# EAGLE design BB-MIGRATED (EAGLE 5.11)
BOM: EXCLUDE; PARTNO: L3G4200DH

## Sheet 1 of 3
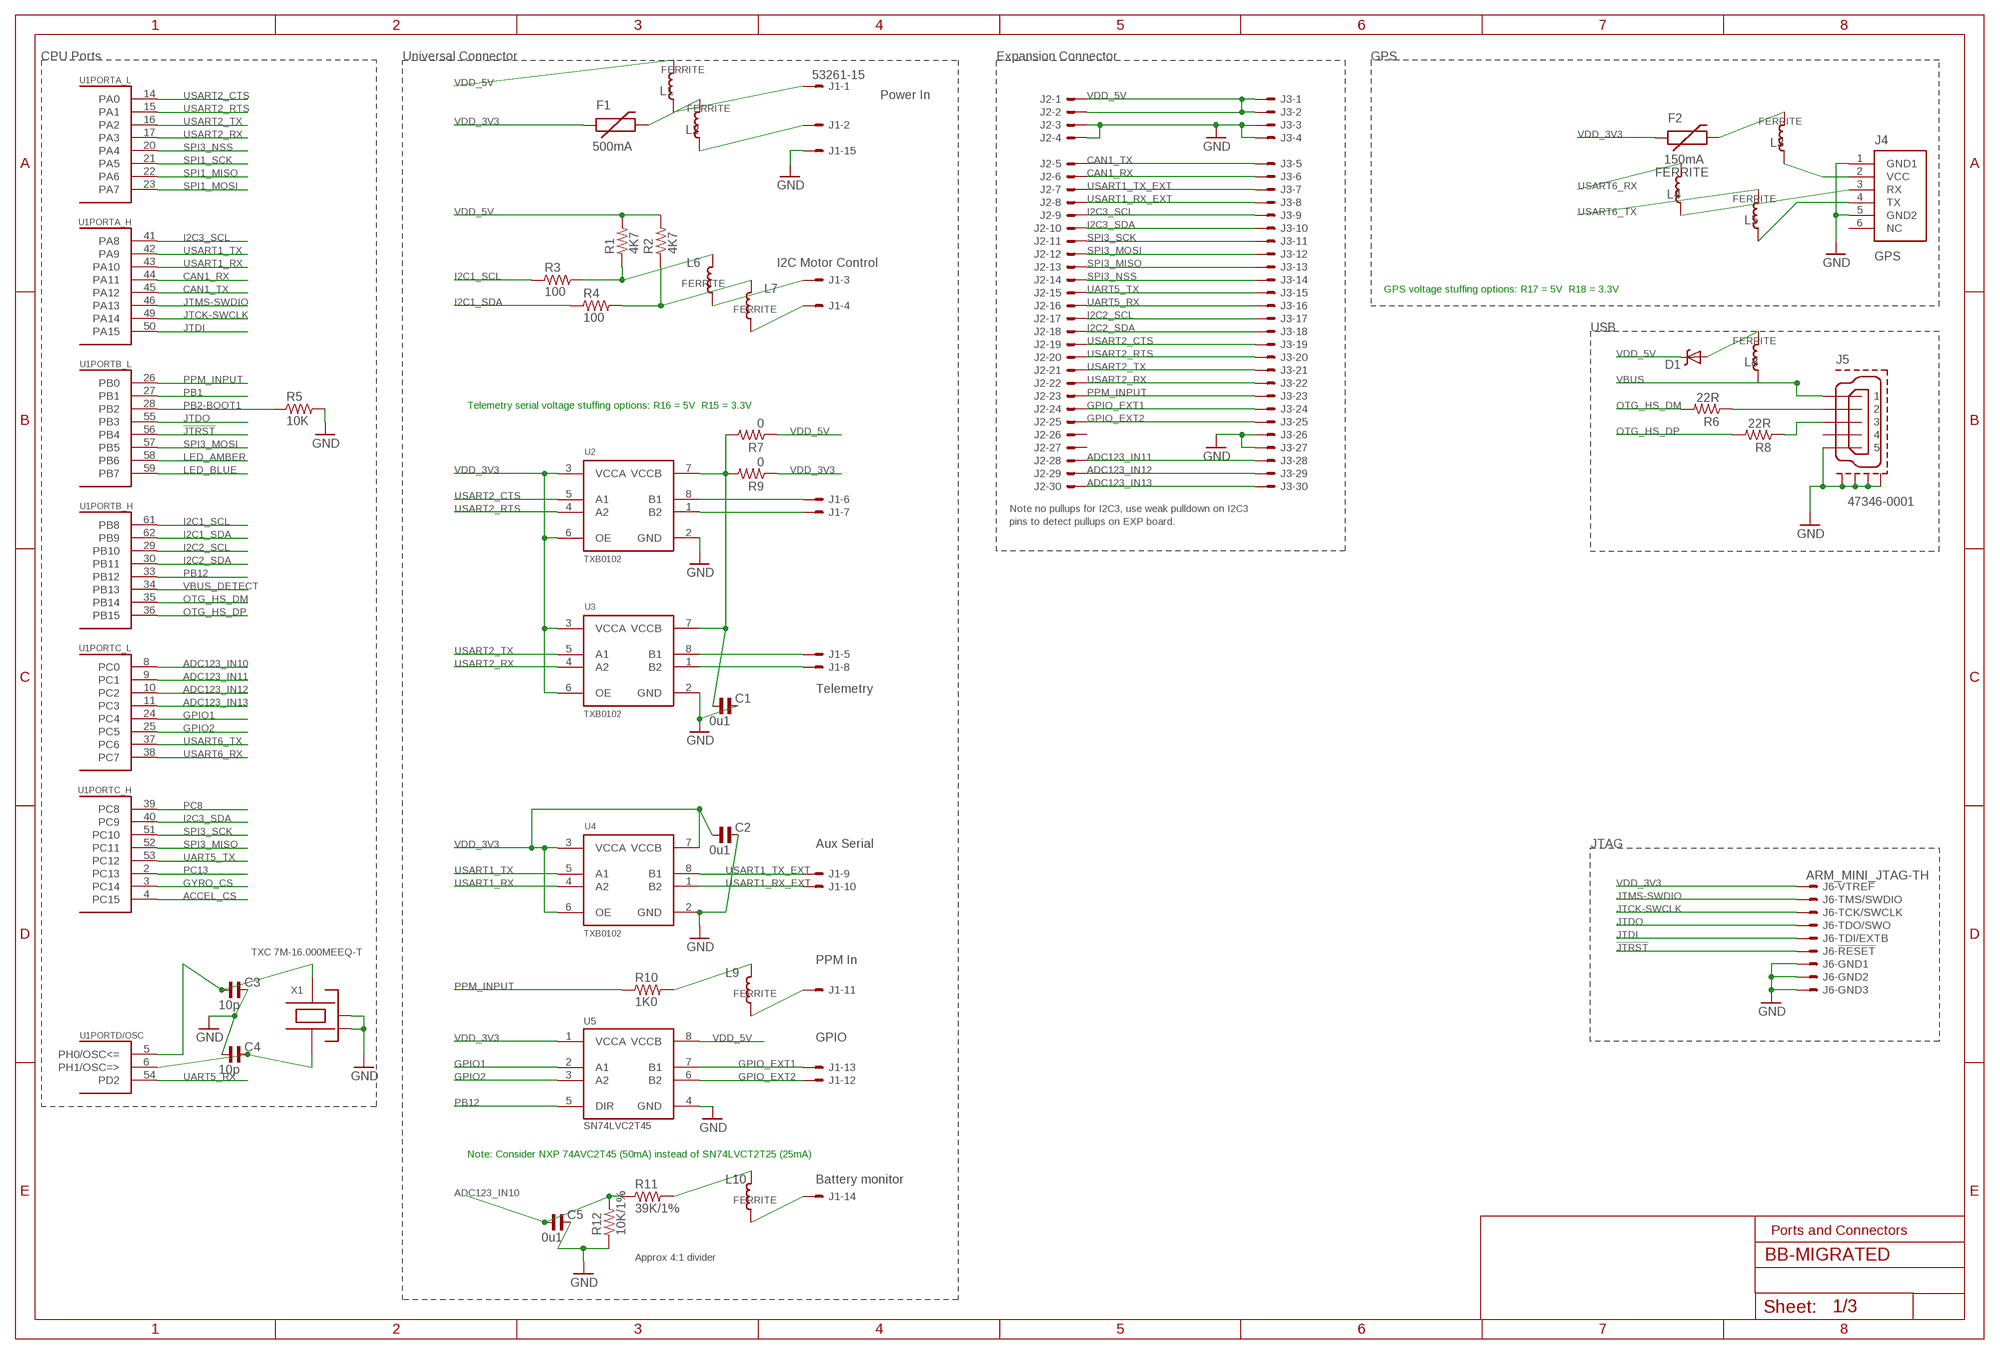
[diagram p0: schematic, sheet 1]

### Parts
C1  0u1  C_0402  [C0402]
C2  0u1  C_0402  [C0402]
C3  10p  C_0402  [C0402]
C4  10p  C_0402  [C0402]
C5  0u1  C_0402  [C0402]
D1  MSS1P4-M3  DIODE-SCHOTTKY_MSMP  [MICROSMP]
F1  500mA  PTC0603  [0603]
F2  150mA  PTC0603  [0603]
J1  53261-15  [53261-15]
J2  HEADER_2X15-REV  [HEADER_2MM_2X15_REVERSE]
J3  HEADER_2X15  [HEADER_2MM_2X15]
J4  GPS  EM406  [EM406]
J5  47346-0001  MOLEX-47346-0001  [MOLEX-47346-0001]
J6  ARM_MINI_JTAG-TH  [FTSH-105-01-XXX-DV]
L1  FERRITE  L_0402  [L0402]
L2  FERRITE  L_0402  [L0402]
L3  FERRITE  L_0402  [L0402]
L4  FERRITE  L_0402  [L0402]
L5  FERRITE  L_0402  [L0402]
L6  FERRITE  L_0402  [L0402]
L7  FERRITE  L_0402  [L0402]
L8  FERRITE  L_0402  [L0402]
L9  FERRITE  L_0402  [L0402]
L10  FERRITE  L_0402  [L0402]
R1  4K7  R_0402  [R0402]
R2  4K7  R_0402  [R0402]
R3  100  R_0402  [R0402]
R4  100  R_0402  [R0402]
R5  10K  R_0402  [R0402]
R6  22R  R_0402  [R0402]
R7  0  R_0402  [R0402]
R8  22R  R_0402  [R0402]
R9  0  R_0402  [R0402]
R10  1K0  R_0402  [R0402]
R11  39K/1%  R_0402  [R0402]
R12  10K/1%  R_0402  [R0402]
U1  STM32F20X_TQFP64  [TQFP64]
U2  TXB0102  [R-PDSO-G08]
U3  TXB0102  [R-PDSO-G08]
U4  TXB0102  [R-PDSO-G08]
U5  SN74LVC2T45  [R-PDSO-G08]
X1  TXC 7M-16.000MEEQ-T  OSCILLATOR-3.2X2.5  [OSCILLATOR-3.2X2.5]

### Nets
!JTRST: J6.10 U1.56(PORTB_L:PB4)
ACCEL_CS: U1.4(PORTC_H:PC15) ; also sheet 3
ADC123_IN10: C5.1 R11.1 R12.2 U1.8(PORTC_L:PC0)
ADC123_IN11: J2.28 J3.28 U1.9(PORTC_L:PC1)
ADC123_IN12: J2.29 J3.29 U1.10(PORTC_L:PC2)
ADC123_IN13: J2.30 J3.30 U1.11(PORTC_L:PC3)
CAN1_RX: J2.6 J3.6 U1.44(PORTA_H:PA11)
CAN1_TX: J2.5 J3.5 U1.45(PORTA_H:PA12)
GND [power]: C1.2 C2.2 C3.2 C4.1 C5.2 J1.15 J2.3 J2.4 J3.3 J3.4 J3.26 J3.27 J4.1(GND1) J4.5(GND2) J5.5 J5.GND1 J5.GND2 J5.GND3 J5.GND4 J6.3 J6.5 J6.9 R5.2 R12.1 U2.2(GND) U3.2(GND) U4.2(GND) U5.4(GND) X1.2(NC_2) X1.4(NC_4) ; also sheet 2,3
GPIO1: U1.24(PORTC_L:PC4) U5.2(A1)
GPIO2: U1.25(PORTC_L:PC5) U5.3(A2)
GPIO_EXT1: J1.13 J2.24 J3.24 U5.7(B1)
GPIO_EXT2: J1.12 J2.25 J3.25 U5.6(B2)
GYRO_CS: U1.3(PORTC_H:PC14) ; also sheet 3
I2C1_SCL: R3.1 U1.61(PORTB_H:PB8)
I2C1_SCL_EXT: L6.1 R1.1 R3.2
I2C1_SDA: R4.1 U1.62(PORTB_H:PB9)
I2C2_SCL: J2.17 J3.17 U1.29(PORTB_H:PB10) ; also sheet 2,3
I2C2_SDA: J2.18 J3.18 U1.30(PORTB_H:PB11) ; also sheet 2,3
I2C2_SDA_EXT: L7.1 R2.1 R4.2
I2C3_SCL: J2.9 J3.9 U1.41(PORTA_H:PA8)
I2C3_SDA: J2.10 J3.10 U1.40(PORTC_H:PC9)
JTCK-SWCLK: J6.4 U1.49(PORTA_H:PA14)
JTDI: J6.8 U1.50(PORTA_H:PA15)
JTDO: J6.6 U1.55(PORTB_L:PB3)
JTMS-SWDIO: J6.2 U1.46(PORTA_H:PA13)
LED_AMBER: U1.58(PORTB_L:PB6) ; also sheet 2
LED_BLUE: U1.59(PORTB_L:PB7) ; also sheet 2
N$1: C4.2 U1.6(PORTD/OSC:PH1/OSC=>) X1.1
N$2: C3.1 U1.5(PORTD/OSC:PH0/OSC<=) X1.3
N$3: J1.2 L2.2
N$5: F2.2 L3.1
N$7: J5.2 R6.1
N$8: J5.3 R8.1
N$11 [power]: C1.1 R7.2 R9.2 U2.7(VCCB) U3.7(VCCB)
N$12: J1.6 U2.8(B1)
N$13: J1.7 U2.1(B2)
N$14 [power]: J1.1 L1.2
N$15: J1.5 U3.8(B1)
N$16: J1.8 U3.1(B2)
N$19: J1.3 L6.2
N$21: J4.3(RX) L4.2
N$23 [power]: D1.ANODE(A) L8.1
N$24 [power]: J4.2(VCC) L3.2
N$25: J4.4(TX) L5.2
N$26: J1.4 L7.2
N$27 [power]: F1.2 L2.1
N$31: L9.1 R10.2
N$32: J1.11 L9.2
N$35: L10.1 R11.2
N$37: J1.14 L10.2
OTG_HS_DM: R6.2 U1.35(PORTB_H:PB14)
OTG_HS_DP: R8.2 U1.36(PORTB_H:PB15)
PB1: U1.27(PORTB_L:PB1)
PB2-BOOT1: R5.1 U1.28(PORTB_L:PB2)
PB12: U1.33(PORTB_H:PB12) U5.5(DIR)
PC8: U1.39(PORTC_H:PC8)
PC13: U1.2(PORTC_H:PC13)
PPM_INPUT: J2.23 J3.23 R10.1 U1.26(PORTB_L:PB0)
SPI1_MISO: U1.22(PORTA_L:PA6) ; also sheet 3
SPI1_MOSI: U1.23(PORTA_L:PA7) ; also sheet 3
SPI1_SCK: U1.21(PORTA_L:PA5) ; also sheet 3
SPI3_MISO: J2.13 J3.13 U1.52(PORTC_H:PC11)
SPI3_MOSI: J2.12 J3.12 U1.57(PORTB_L:PB5)
SPI3_NSS: J2.14 J3.14 U1.20(PORTA_L:PA4)
SPI3_SCK: J2.11 J3.11 U1.51(PORTC_H:PC10)
UART5_RX: J2.16 J3.16 U1.54(PORTD/OSC:PD2)
UART5_TX: J2.15 J3.15 U1.53(PORTC_H:PC12)
USART1_RX: U1.43(PORTA_H:PA10) U4.4(A2)
USART1_RX_EXT: J1.10 J2.8 J3.8 U4.1(B2)
USART1_TX: U1.42(PORTA_H:PA9) U4.5(A1)
USART1_TX_EXT: J1.9 J2.7 J3.7 U4.8(B1)
USART2_CTS: J2.19 J3.19 U1.14(PORTA_L:PA0) U2.5(A1)
USART2_RTS: J2.20 J3.20 U1.15(PORTA_L:PA1) U2.4(A2)
USART2_RX: J2.22 J3.22 U1.17(PORTA_L:PA3) U3.4(A2)
USART2_TX: J2.21 J3.21 U1.16(PORTA_L:PA2) U3.5(A1)
USART6_RX: L4.1 U1.38(PORTC_L:PC7)
USART6_TX: L5.1 U1.37(PORTC_L:PC6)
VBUS [power]: J5.1 L8.2 ; also sheet 2
VBUS_DETECT: U1.34(PORTB_H:PB13) ; also sheet 2
VDD_3V3 [power]: C2.1 F1.1 F2.1 J6.1 R9.1 U2.3(VCCA) U2.6(OE) U3.3(VCCA) U3.6(OE) U4.3(VCCA) U4.6(OE) U4.7(VCCB) U5.1(VCCA) ; also sheet 2,3
VDD_5V [power]: D1.CATHODE(C) J2.1 J2.2 J3.1 J3.2 L1.1 R1.2 R2.2 R7.1 U5.8(VCCB) ; also sheet 2
Unconnected: J2.26 J2.27 J4.6(NC) J5.4

### Notes on the sheet
- CPU Ports | Universal Connector | Expansion Connector | GPS
- Power In
- I2C Motor Control
- GPS voltage stuffing options: R17 = 5V  R18 = 3.3V
- USB
- Telemetry serial voltage stuffing options: R16 = 5V  R15 = 3.3V
- Note no pullups for I2C3, use weak pulldown on I2C3
- pins to detect pullups on EXP board.
- Telemetry
- Aux Serial | JTAG
- PPM In
- GPIO
- Note: Consider NXP 74AVC2T45 (50mA) instead of SN74LVCT2T25 (25mA)
- Battery monitor
- Ports and Connectors
- Approx 4:1 divider

## Sheet 2 of 3
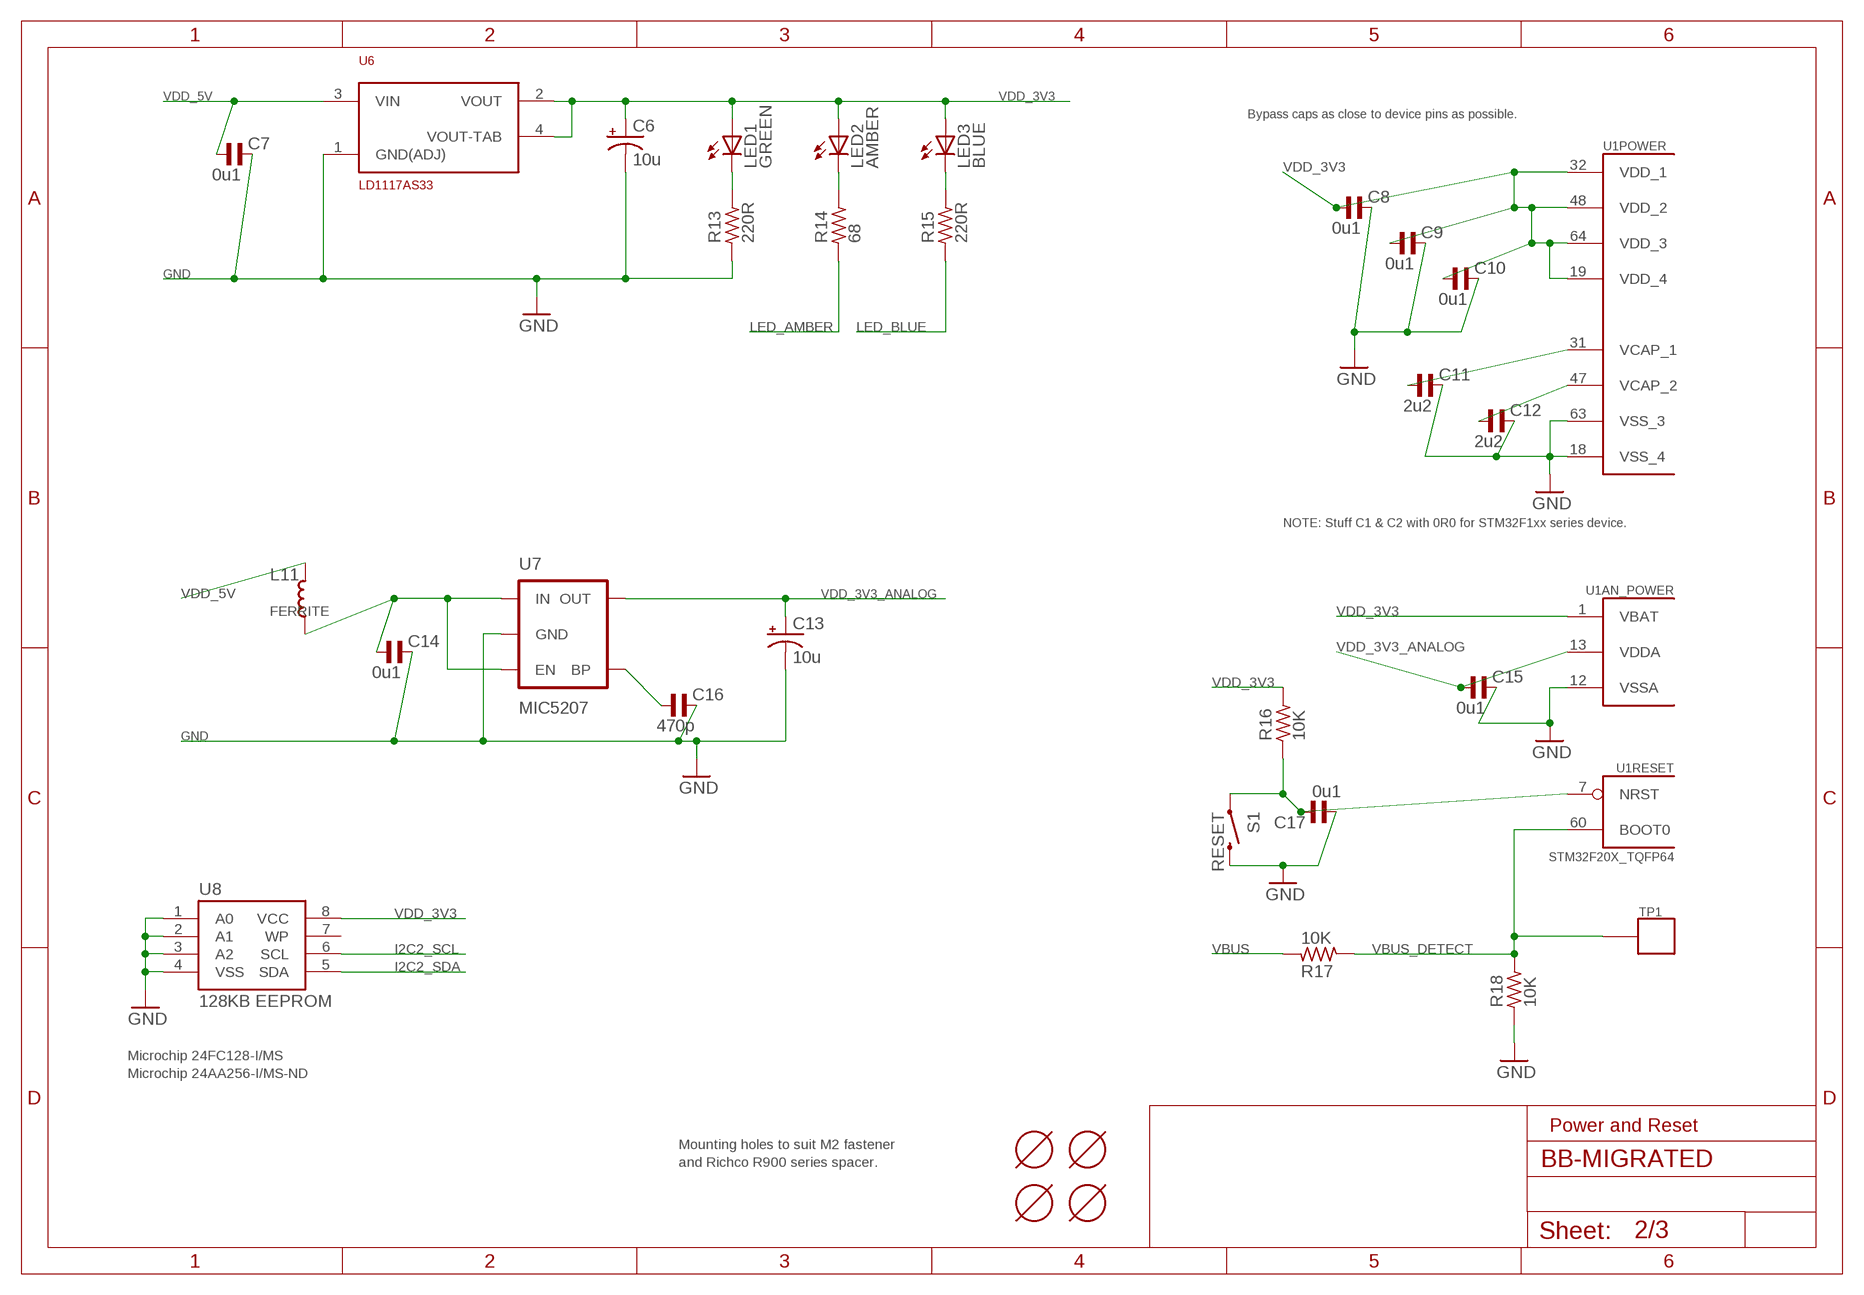
[diagram p1: schematic, sheet 2]

### Parts
C6  10u  CAP_POL1206  [EIA3216]
C7  0u1  C_0402  [C0402]
C8  0u1  C_0402  [C0402]
C9  0u1  C_0402  [C0402]
C10  0u1  C_0402  [C0402]
C11  2u2  C_0402  [C0402]
C12  2u2  C_0402  [C0402]
C13  10u  CAP_POL1206  [EIA3216]
C14  0u1  C_0402  [C0402]
C15  0u1  C_0402  [C0402]
C16  470p  C_0402  [C0402]
C17  0u1  C_0402  [C0402]
L11  FERRITE  L_0402  [L0402]
LED1  GREEN  LED0603  [LED-0603]
LED2  AMBER  LED0603  [LED-0603]
LED3  BLUE  LED0603  [LED-0603]
R13  220R  R_0402  [R0402]
R14  68  R_0402  [R0402]
R15  220R  R_0402  [R0402]
R16  10K  R_0402  [R0402]
R17  10K  R_0402  [R0402]
R18  10K  R_0402  [R0402]
S1  RESET  SWITCH-MOMENTARY-2  [EVQP7J01K]
TP1  PAD.03  [PAD.03X.03]
U6  LD1117AS33  [SOT-223]
U7  MIC5207  V_REG_LDOSMD  [SOT23-5]
U8  128KB EEPROM  EEPROM-I2CMSOP  [MSOP-8]
U$1  MOUNT-HOLE2.1MM  [MOUNT-HOLE2.1]
U$2  MOUNT-HOLE2.1MM  [MOUNT-HOLE2.1]
U$3  MOUNT-HOLE2.1MM  [MOUNT-HOLE2.1]
U$4  MOUNT-HOLE2.1MM  [MOUNT-HOLE2.1]

### Nets
GND [power]: C6.C(-) C7.2 C8.2 C9.2 C10.2 C11.2 C12.2 C13.C(-) C14.2 C15.2 C16.2 C17.1 R13.1 R18.1 S1.B3 U1.12(AN_POWER:VSSA) U1.18(POWER:VSS_4) U1.63(POWER:VSS_3) U6.1(GND(ADJ)) U7.2(GND) U8.1(A0) U8.2(A1) U8.3(A2) U8.4(VSS) ; also sheet 1,3
I2C2_SCL: U8.6(SCL) ; also sheet 1,3
I2C2_SDA: U8.5(SDA) ; also sheet 1,3
LED_AMBER: R14.1 ; also sheet 1
LED_BLUE: R15.1 ; also sheet 1
N$4: C11.1 U1.31(POWER:VCAP_1)
N$6: C12.1 U1.47(POWER:VCAP_2)
N$9: C16.1 U7.4(BP)
N$22: C17.2 R16.1 S1.A1 U1.7(RESET:NRST)
N$28: LED3.C R15.2
N$29: LED1.C R13.2
N$30: LED2.C R14.2
N$100 [power]: C14.1 L11.2 U7.1(IN) U7.3(EN)
VBUS [power]: R17.1 ; also sheet 1
VBUS_DETECT: R17.2 R18.2 TP1.P$1 U1.60(RESET:BOOT0) ; also sheet 1
VDD_3V3 [power]: C6.A(+) C8.1 C9.1 C10.1 LED1.A LED2.A LED3.A R16.2 U1.1(AN_POWER:VBAT) U1.19(POWER:VDD_4) U1.32(POWER:VDD_1) U1.48(POWER:VDD_2) U1.64(POWER:VDD_3) U6.2(VOUT) U6.4(VOUT-TAB) U8.8(VCC) ; also sheet 1,3
VDD_3V3_ANALOG [power]: C13.A(+) C15.1 U1.13(AN_POWER:VDDA) U7.5(OUT) ; also sheet 3
VDD_5V [power]: C7.1 L11.1 U6.3(VIN) ; also sheet 1
Unconnected: U8.7(WP)

### Notes on the sheet
- Bypass caps as close to device pins as possible.
- NOTE: Stuff C1 & C2 with 0R0 for STM32F1xx series device.
- Microchip 24FC128-I/MS
- Microchip 24AA256-I/MS-ND
- Power and Reset
- Mounting holes to suit M2 fastener
- and Richco R900 series spacer.

## Sheet 3 of 3
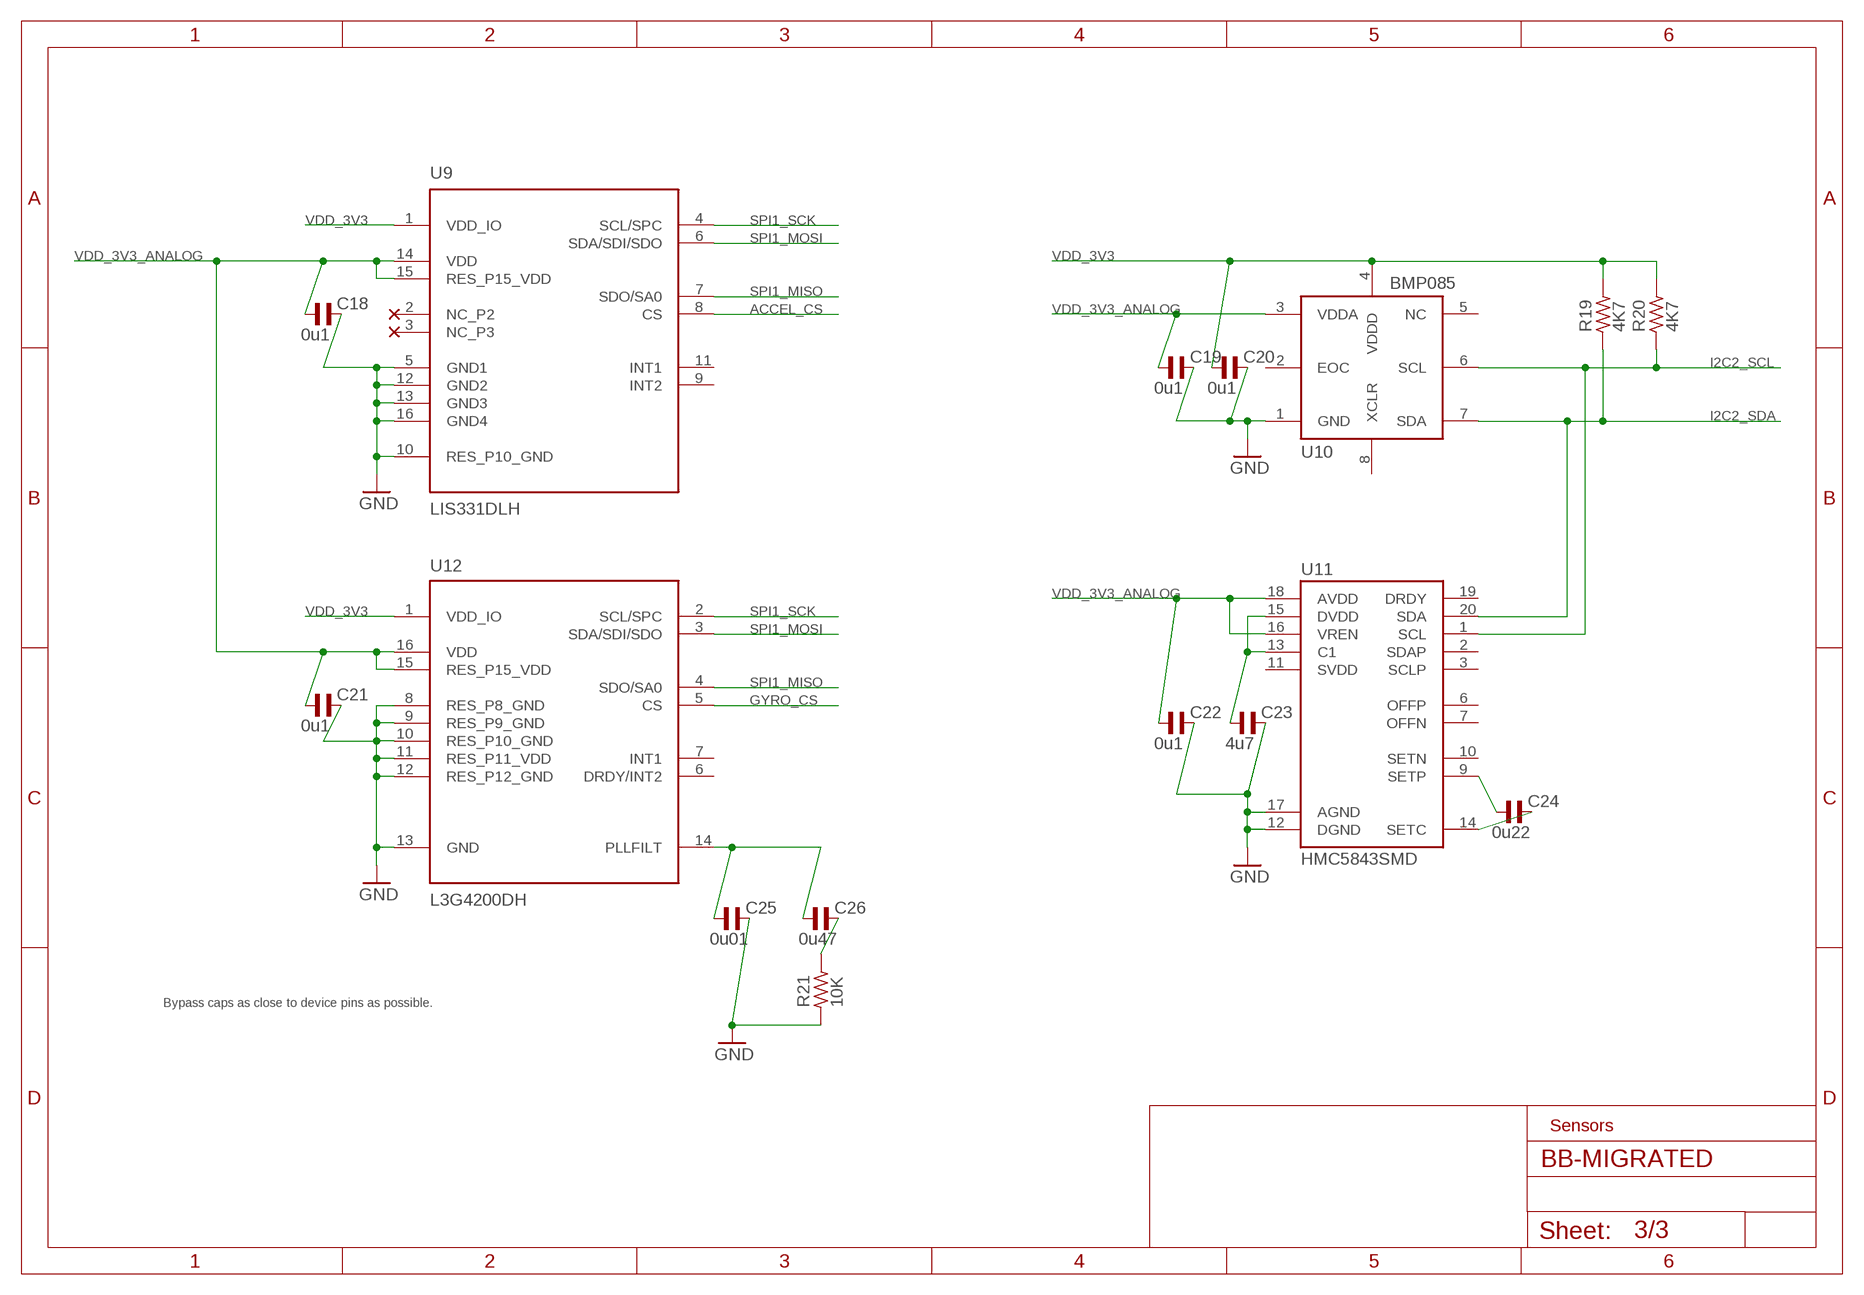
[diagram p2: schematic, sheet 3]

### Parts
C18  0u1  C_0402  [C0402]
C19  0u1  C_0402  [C0402]
C20  0u1  C_0402  [C0402]
C21  0u1  C_0402  [C0402]
C22  0u1  C_0402  [C0402]
C23  4u7  C_0402  [C0402]
C24  0u22  C_0402  [C0402]
C25  0u01  C_0402  [C0402]
C26  0u47  C_0402  [C0402]
R19  4K7  R_0402  [R0402]
R20  4K7  R_0402  [R0402]
R21  10K  R_0402  [R0402]
U9  LIS331DLH  LIS331DLH-LL  [LIS331DLH-MAN]
U10  BMP085  [BMP085]
U11  HMC5843SMD  HMC5843  [LPCC20]
U12  L3G4200DH  L3G4200DH-LL  [L3G4200DH-MAN]

### Nets
ACCEL_CS: U9.8(CS) ; also sheet 1
GND [power]: C18.2 C19.2 C20.2 C21.2 C22.2 C23.2 C25.2 R21.1 U9.5(GND1) U9.10(RES_P10_GND) U9.12(GND2) U9.13(GND3) U9.16(GND4) U10.1(GND) U11.12(DGND) U11.17(AGND) U12.8(RES_P8_GND) U12.9(RES_P9_GND) U12.10(RES_P10_GND) U12.11(RES_P11_VDD) U12.12(RES_P12_GND) U12.13(GND) ; also sheet 1,2
GYRO_CS: U12.5(CS) ; also sheet 1
I2C2_SCL: R20.1 U10.6(SCL) U11.1(SCL) ; also sheet 1,2
I2C2_SDA: R19.1 U10.7(SDA) U11.20(SDA) ; also sheet 1,2
N$33: C26.2 R21.2
N$34: C25.1 C26.1 U12.14(PLLFILT)
N$36: C23.1 U11.13(C1) U11.15(DVDD)
N$39: C24.2 U11.14(SETC)
N$40: C24.1 U11.9(SETP)
SPI1_MISO: U9.7(SDO/SA0) U12.4(SDO/SA0) ; also sheet 1
SPI1_MOSI: U9.6(SDA/SDI/SDO) U12.3(SDA/SDI/SDO) ; also sheet 1
SPI1_SCK: U9.4(SCL/SPC) U12.2(SCL/SPC) ; also sheet 1
VDD_3V3 [power]: C20.1 R19.2 R20.2 U9.1(VDD_IO) U10.4(VDDD) U12.1(VDD_IO) ; also sheet 1,2
VDD_3V3_ANALOG [power]: C18.1 C19.1 C21.1 C22.1 U9.14(VDD) U9.15(RES_P15_VDD) U10.3(VDDA) U11.16(VREN) U11.18(AVDD) U12.15(RES_P15_VDD) U12.16(VDD) ; also sheet 2
Unconnected: U9.2(NC_P2) U9.3(NC_P3) U9.9(INT2) U9.11(INT1) U10.2(EOC) U10.5(NC) U10.8(XCLR) U11.2(SDAP) U11.3(SCLP) U11.6(OFFP) U11.7(OFFN) U11.10(SETN) U11.11(SVDD) U11.19(DRDY) U12.6(DRDY/INT2) U12.7(INT1)

### Notes on the sheet
- Bypass caps as close to device pins as possible.
- Sensors

## Library data of the parts
C1-C5 C7-C12 C14-C26 = rc-master-smd:C_: NON-POLARIZED CAP
C6 C13 = pixhawk2:CAP_POL: Capacitor Polarized These are standard SMD and PTH capacitors. Normally 10uF, 47uF, and 100uF in electrolytic and tantalum varieties. Always verify the external diameter of the through hole cap, it varies with capacity, voltage, and manufacturer. The EIA devices should be standard.
D1 = pixhawk2:DIODE-SCHOTTKY: Schottky barrier diode in DO214AC, e.g. Fairchild SS14.
F1 F2 = pixhawk2:PTC: Resettable Fuse PTC Resettable Fuse. Spark Fun Electronics SKU : COM-08357
J1 = pixhawk2:53?-15: CONNECTOR wire to board 1.25 mm (.049 inch) pitch header
J2 J3 = pixhawk2:HEADER_2X15: 2X15 header
J4 = SparkFun:EM406: EM406 Connector Proven layout and schematic for EM406 connector. Spark Fun Electronics SKU : GPS-00579
J5 = pixhawk2:MOLEX-47346-0001: MICRO USB B, BOTTOM MOUNT
J6 = pixhawk2:ARM_MINI_JTAG: CONNECTOR wire to board 1.25 mm (.049 inch) pitch header
L1-L11 = rc-master-smd:L_: INDUCTOR
LED1-LED3 = pixhawk2:LED: LEDs Standard schematic elements and footprints for 5mm, 3mm, 1206, and 0603 sized LEDs. 5mm - Spark Fun Electronics SKU : COM-00529 (and others)
R1-R21 = rc-master-smd:R_: RESISTOR
S1 = pixhawk2:SWITCH-MOMENTARY-2
TP1 = pixhawk2:PAD
U1 = pixhawk2:STM32F20X_TQFP64: STM32F20x 64pin LQFP
U2-U4 = pixhawk2:TXB0102: 2-BIT BIDIRECTIONAL VOLTAGE-LEVEL TRANSLATOR WITH AUTO DIRECTION SENSING AND ±15-kV ESD PROTECTION
U5 = pixhawk2:SN74LVC2T45: DUAL-BIT DUAL-SUPPLY BUS TRANSCEIVER WITH CONFIGURABLE VOLTAGE TRANSLATION AND 3-STATE OUTPUTS
U6 = pixhawk2:LD1117A: LD1117A LDO Datasheet: http://www.st.com/stonline/books/pdf/docs/7194.pdf
U7 = pixhawk2:V_REG_LDO: Voltage Regulator LDO Standard 150mA LDO voltage regulator in SOT-23 layout. Micrel part MIC5205. BP (by-pass) pin is used to lower output noise with 470pF cap.
U8 = pixhawk2:EEPROM-I2C
U9 = pixhawk2:LIS331DLH: LIS331DLH - Digital 3-axis accelerometer The LIS331DLH is an ultra low-power high performance three axes linear accelerometer belonging to the ?nano? family, with digital I2C/SPI serial interface standard output. The LIS331DLH has dynamically user selectable full scales of ±2g/±4g/±8g and it is capable of measuring accelerations with output data rates from 0.5 Hz to 1 kHz. It is guaranteed to operate over an extended temperature range from -40 °C to +85 °C. LIS331DLH Datasheet <http://www.st.com/internet/com/TECHNICAL_RESOURCES/TECHNICAL_LITERATURE/DATASHEET/CD00213470.pdf>
U10 = pixhawk2:BMP085
U11 = pixhawk2:HMC5843
U12 = pixhawk2:L3G4200DH: L3G4200DH - Digital 3-axis Gyroscope The L3G4200DH is a low-power three-axis angular rate sensor. The L3G4200DH has a full scale of ±250/±500/ ±2000 dps and is capable of measuring rates with a user-selectable bandwidth. It can operate within a temperature range from -40 °C to +85 °C. Supply voltage: 2.4 V to 3.6 V. Full datasheet: L3G4200DH Datasheet <http://www.st.com/stonline/products/literature/ds/17300.pdf>
U$1-U$4 = pixhawk2:MOUNT-HOLE
X1 = pixhawk2:OSCILLATOR: Crystal Oscillator in 3.2x2.5 SMD

## Net classes
0 signal: width 0.203 mm, drill 0.3 mm, clearance 0.203 mm
1 power: width 0.254 mm, drill 0.3 mm, clearance 0.203 mm

## Board
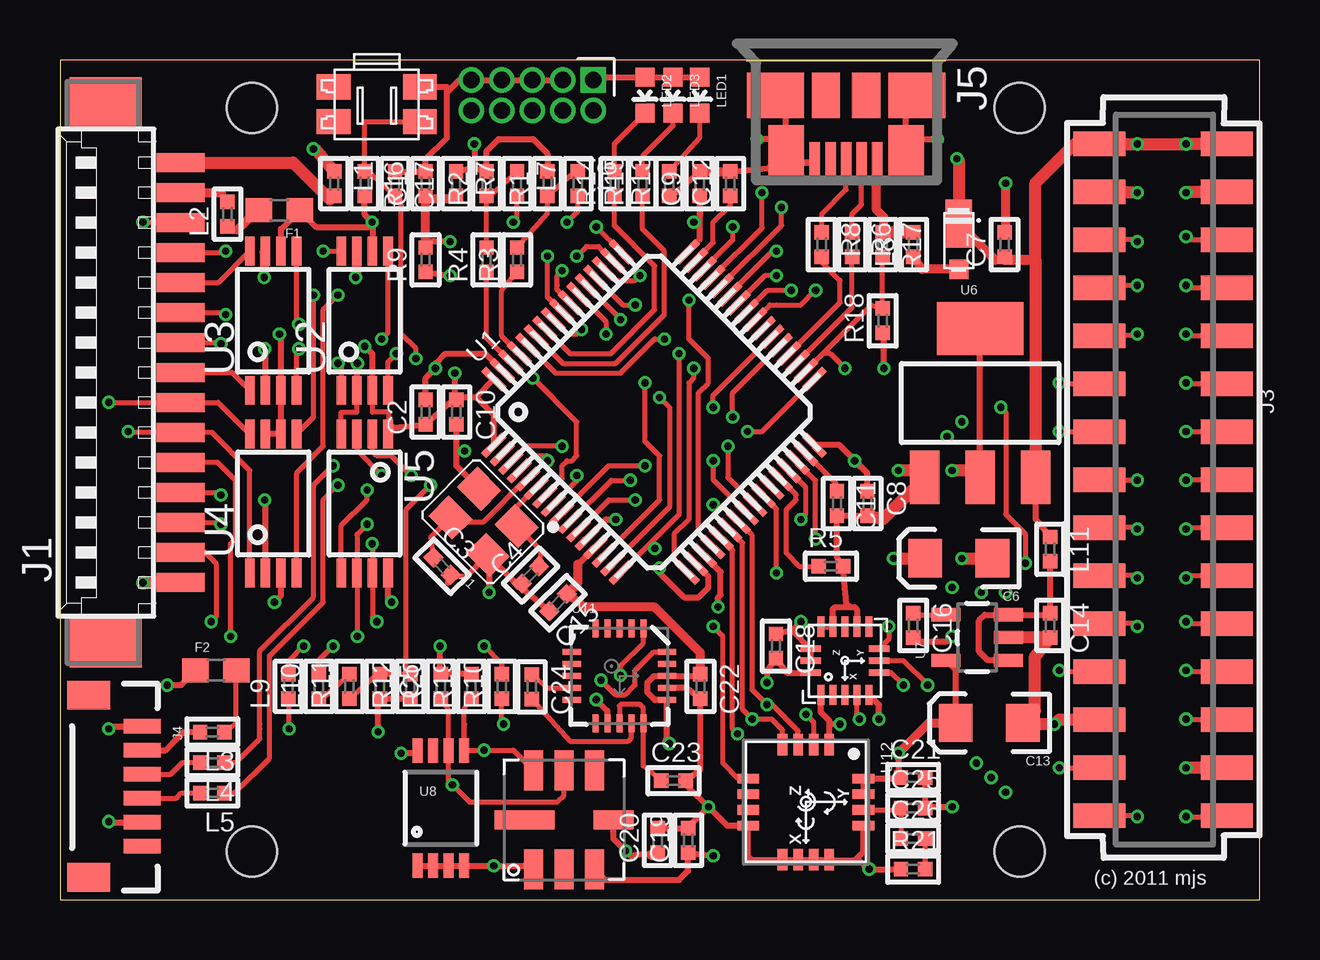
[diagram p3: board, top side]
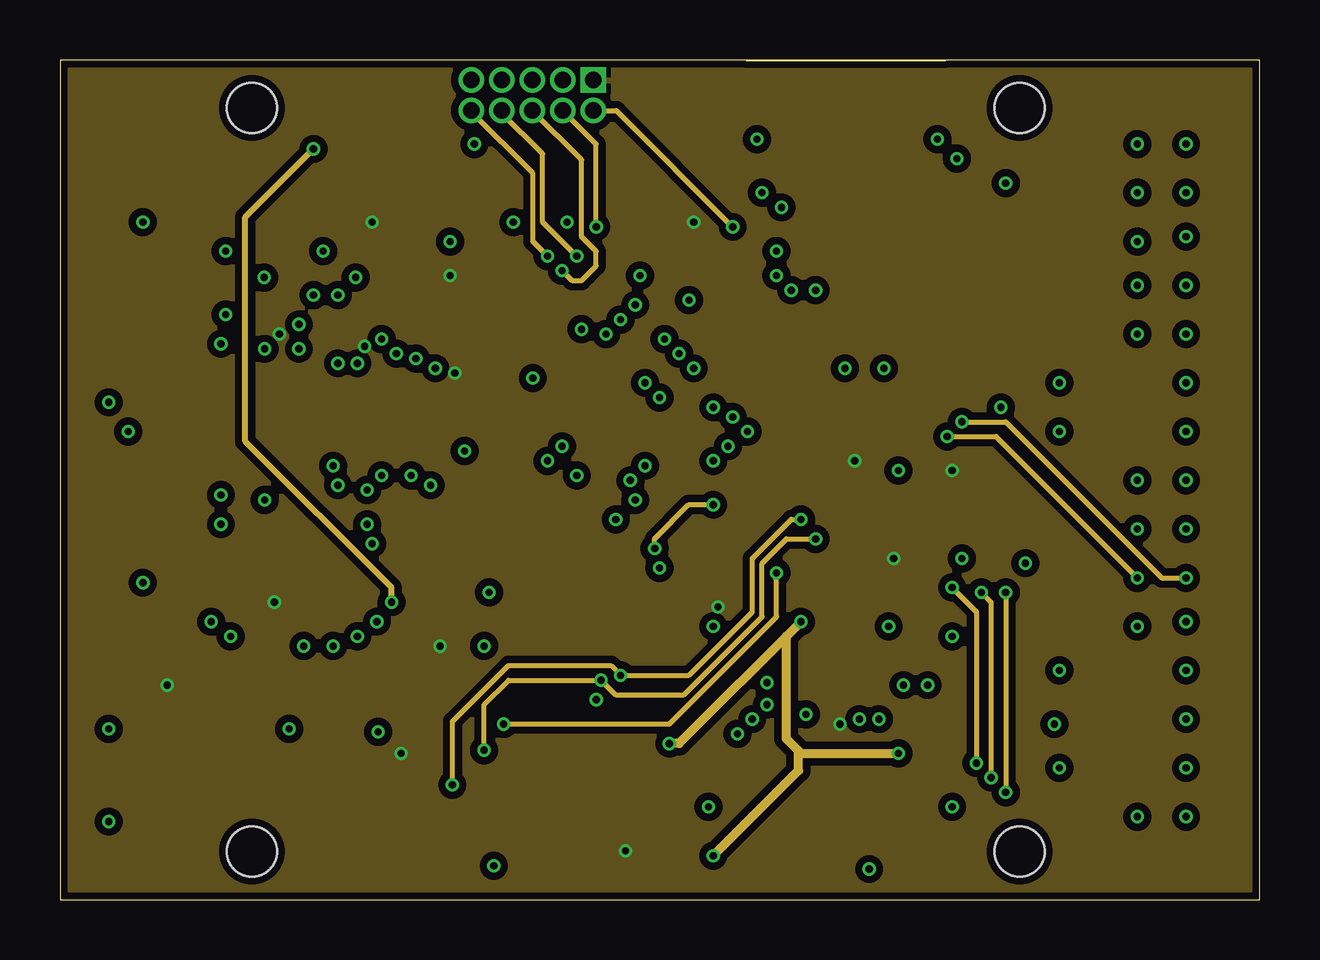
[diagram p4: board, inner layer Route2]
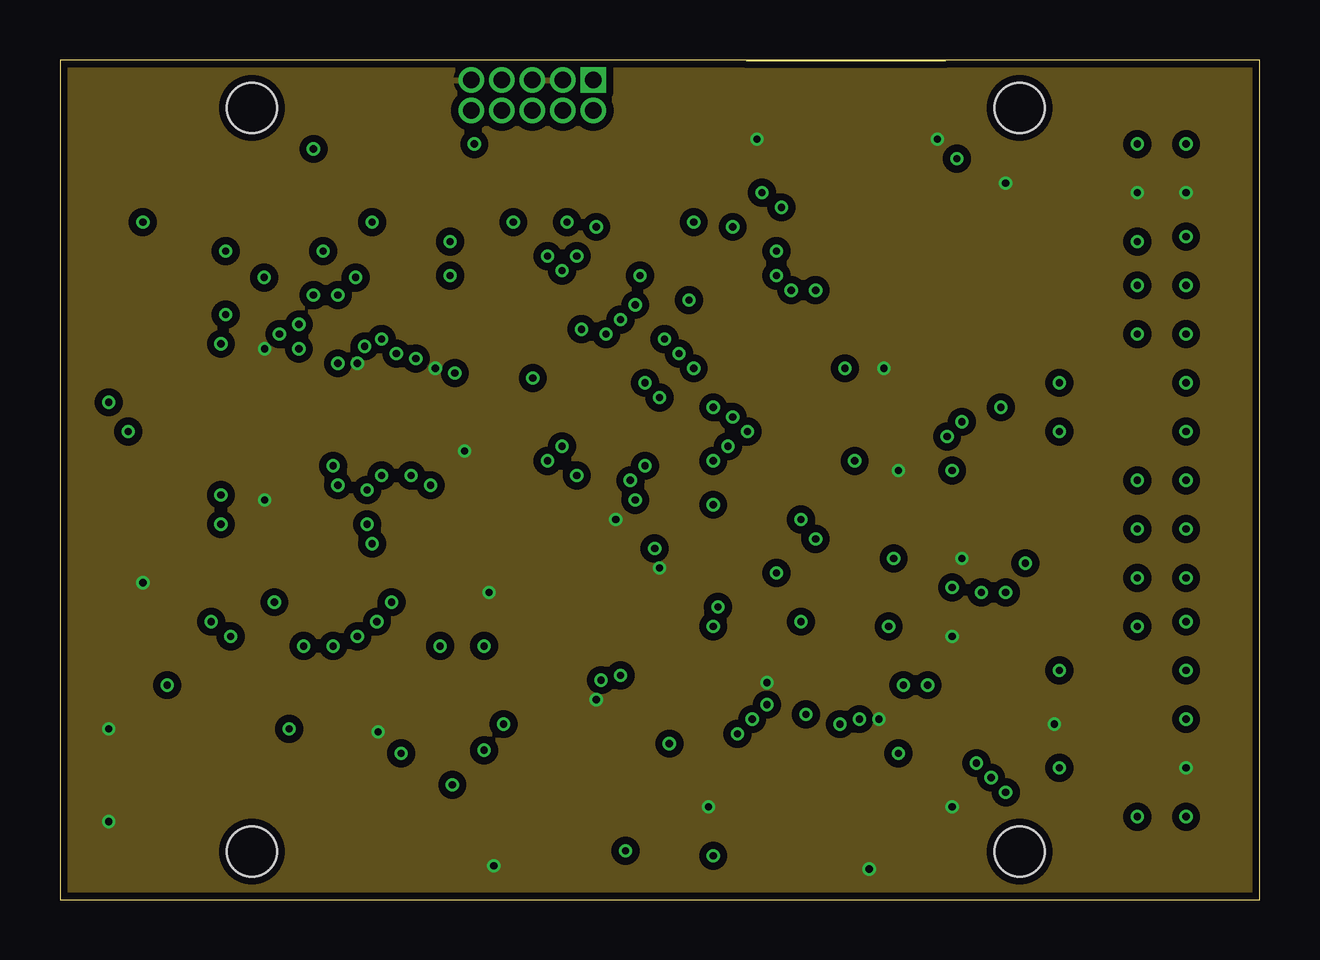
[diagram p5: board, inner layer Route15]
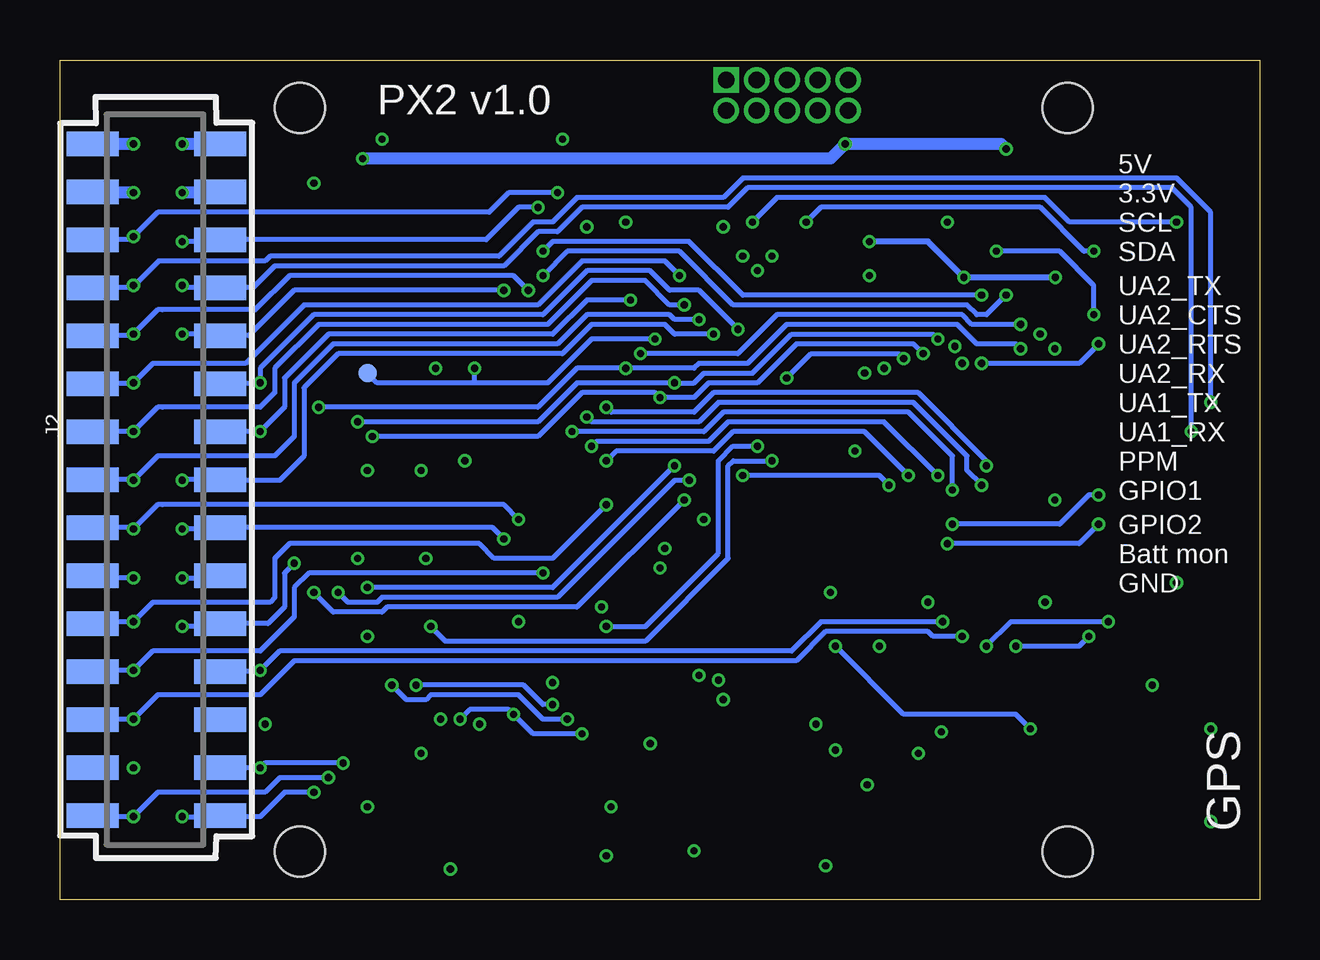
[diagram p6: board, bottom side, seen from below]

Size 50 x 35 mm. Coordinates in mm from the lower left corner, seen from the top.
Outline: 0,0 50,0 50,35 0,35 0,0
Copper layers (1*2*15*16): Top 0.035mm / dielectric 0.5mm / Route2 0.035mm / dielectric 0.5mm / Route15 0.035mm / dielectric 0.5mm / Bottom 0.035mm
Design rules "pixhawk2 *": minimum track width 0.15mm, minimum drill 0.2mm, track to track 0.15mm, track to pad 0.15mm, pad to pad 0.15mm, via to via 0.15mm, smd to smd 0.15mm, copper to edge 0.2mm, drill to drill 0.2mm, minimum pad ring 0.125mm, minimum via ring 0.125mm, stop-mask expansion 3mil, vias tented up to drill 0.3mm, thermal gap 8mil

### Footprints (pad centres in the part's own frame; a part is rotated, then mirrored left to right if it is on the bottom)
C0402 = smd 0.6 x 0.6: 1 -0.508,0; 2 0.508,0
EIA3216 = smd 1.4 x 1.6: A 1.4,0; C -1.4,0
MICROSMP = smd 0.8 x 0.8: ANODE 0.65,0 | smd 2 x 1.1: CATHODE -1.25,0
0603 = smd 1.1 x 1: 1 -0.85,0; 2 0.85,0
53261-15 = smd 0.8 x 2: 1 8.75,-2.5; 2 7.5,-2.5; 3 6.25,-2.5; 4 5,-2.5; 5 3.75,-2.5; 6 2.5,-2.5; 7 1.25,-2.5; 8 0,-2.5; 9 -1.25,-2.5; 10 -2.5,-2.5; 11 -3.75,-2.5; 12 -5,-2.5; 13 -6.25,-2.5; 14 -7.5,-2.5; 15 -8.75,-2.5 | smd 2.1 x 3: S1 11.25,0.625; S2 -11.25,0.625
HEADER_2MM_2X15_REVERSE = smd 1.02 x 2.16: 1 -14,-2.655; 2 -14,2.655; 3 -12,-2.655; 4 -12,2.655; 5 -10,-2.655; 6 -10,2.655; 7 -8,-2.655; 8 -8,2.655; 9 -6,-2.655; 10 -6,2.655; 11 -4,-2.655; 12 -4,2.655; 13 -2,-2.655; 14 -2,2.655; 15 0,-2.655; 16 0,2.655; 17 2,-2.655; 18 2,2.655; 19 4,-2.655; 20 4,2.655; 21 6,-2.655; 22 6,2.655; 23 8,-2.655; 24 8,2.655; 25 10,-2.655; 26 10,2.655; 27 12,-2.655; 28 12,2.655; 29 14,-2.655; 30 14,2.655
HEADER_2MM_2X15 = smd 1.02 x 2.16: 1 14,-2.655; 2 14,2.655; 3 12,-2.655; 4 12,2.655; 5 10,-2.655; 6 10,2.655; 7 8,-2.655; 8 8,2.655; 9 6,-2.655; 10 6,2.655; 11 4,-2.655; 12 4,2.655; 13 2,-2.655; 14 2,2.655; 15 0,-2.655; 16 0,2.655; 17 -2,-2.655; 18 -2,2.655; 19 -4,-2.655; 20 -4,2.655; 21 -6,-2.655; 22 -6,2.655; 23 -8,-2.655; 24 -8,2.655; 25 -10,-2.655; 26 -10,2.655; 27 -12,-2.655; 28 -12,2.655; 29 -14,-2.655; 30 -14,2.655
EM406 = smd 0.6 x 1.55: 1 0,0; 2 1,0; 3 2,0; 4 3,0; 5 4,0; 6 5,0 | smd 1.2 x 1.8: P$1 -1.3,-2.225; P$2 6.3,-2.225
MOLEX-47346-0001 = smd 1.7 x 0.44: 1 2.8,1.3; 2 2.8,0.65; 3 2.8,0; 4 2.8,-0.65; 5 2.8,-1.3 | smd 1.9 x 2.375: GND1 0,2.95; GND4 0,-2.95 | smd 2.1 x 1.475: GND2 2.3,2.5; GND3 2.3,-2.5 | smd 1.9 x 1.175: GND5 0,-0.838; GND6 0,0.838
FTSH-105-01-XXX-DV = drill 0.7 pad 1.067 square: 1 0,0 | drill 0.7 pad 1.067 round: 2 0,1.27; 3 1.27,0; 4 1.27,1.27; 5 2.54,0; 6 2.54,1.27; 7 3.81,0; 8 3.81,1.27; 9 5.08,0; 10 5.08,1.27
L0402 = smd 0.6 x 0.6: 1 -0.508,0; 2 0.508,0
LED-0603 = smd 0.8 x 0.8: A 0,-0.75; C 0,0.75
R0402 = smd 0.6 x 0.6: 1 -0.508,0; 2 0.508,0
EVQP7J01K = smd 1.4 x 1.05: A1 -1.8,0.725; A2 1.8,0.725; B3 -1.8,-0.725; B4 1.8,-0.725
PAD.03X.03 = smd 0.762 x 0.762: P$1 0,0
TQFP64 = smd 1.2 x 0.29: 1 -5.7,3.75; 2 -5.7,3.25; 3 -5.7,2.75; 4 -5.7,2.25; 5 -5.7,1.75; 6 -5.7,1.25; 7 -5.7,0.75; 8 -5.7,0.25; 9 -5.7,-0.25; 10 -5.7,-0.75; 11 -5.7,-1.25; 12 -5.7,-1.75; 13 -5.7,-2.25; 14 -5.7,-2.75; 15 -5.7,-3.25; 16 -5.7,-3.75; 33 5.7,-3.75; 34 5.7,-3.25; 35 5.7,-2.75; 36 5.7,-2.25; 37 5.7,-1.75; 38 5.7,-1.25; 39 5.7,-0.75; 40 5.7,-0.25; 41 5.7,0.25; 42 5.7,0.75; 43 5.7,1.25; 44 5.7,1.75; 45 5.7,2.25; 46 5.7,2.75; 47 5.7,3.25; 48 5.7,3.75 | smd 0.29 x 1.2: 17 -3.75,-5.7; 18 -3.25,-5.7; 19 -2.75,-5.7; 20 -2.25,-5.7; 21 -1.75,-5.7; 22 -1.25,-5.7; 23 -0.75,-5.7; 24 -0.25,-5.7; 25 0.25,-5.7; 26 0.75,-5.7; 27 1.25,-5.7; 28 1.75,-5.7; 29 2.25,-5.7; 30 2.75,-5.7; 31 3.25,-5.7; 32 3.75,-5.7; 49 3.75,5.7; 50 3.25,5.7; 51 2.75,5.7; 52 2.25,5.7; 53 1.75,5.7; 54 1.25,5.7; 55 0.75,5.7; 56 0.25,5.7; 57 -0.25,5.7; 58 -0.75,5.7; 59 -1.25,5.7; 60 -1.75,5.7; 61 -2.25,5.7; 62 -2.75,5.7; 63 -3.25,5.7; 64 -3.75,5.7
R-PDSO-G08 = smd 0.4 x 1.2: 1 -0.975,-2.9; 2 -0.325,-2.9; 3 0.325,-2.9; 4 0.975,-2.9; 5 0.975,2.9; 6 0.325,2.9; 7 -0.325,2.9; 8 -0.975,2.9
SOT-223 = smd 1.219 x 2.235: 1 -2.311,-3.099; 2 0,-3.099; 3 2.311,-3.099 | smd 3.6 x 2.2: 4 0,3.099
SOT23-5 = smd 0.55 x 1.2: 1 -0.95,-1.3; 2 0,-1.3; 3 0.95,-1.3; 4 0.95,1.3; 5 -0.95,1.3
MSOP-8 = smd 0.41 x 1.02: 1 -0.975,-2.4; 2 -0.325,-2.4; 3 0.325,-2.4; 4 0.975,-2.4; 5 0.975,2.4; 6 0.325,2.4; 7 -0.325,2.4; 8 -0.975,2.4
LIS331DLH-MAN = smd 0.85 x 0.285: 1 -1.425,1; 2 -1.425,0.5; 3 -1.425,0; 4 -1.425,-0.5; 5 -1.425,-1; 9 1.425,-1; 10 1.425,-0.5; 11 1.425,0; 12 1.425,0.5; 13 1.425,1 | smd 0.285 x 0.85: 6 -0.5,-1.425; 7 0,-1.425; 8 0.5,-1.425; 14 0.5,1.425; 15 0,1.425; 16 -0.5,1.425
BMP085 = smd 1.67 x 0.8: 1 -2.065,1.27; 2 -2.065,0; 3 -2.065,-1.27; 5 2.065,-1.27; 6 2.065,0; 7 2.065,1.27 | smd 0.8 x 1.67: 4 0,-2.065 | smd 0.8 x 2.5: 8 0,1.65
LPCC20 = smd 0.25 x 0.76: 1 1,1.98; 2 0.5,1.98; 3 0,1.98; 4 -0.5,1.98; 5 -1,1.98; 11 -1,-1.98; 12 -0.5,-1.98; 13 0,-1.98; 14 0.5,-1.98; 15 1,-1.98 | smd 0.76 x 0.25: 6 -1.98,1; 7 -1.98,0.5; 8 -1.98,0; 9 -1.98,-0.5; 10 -1.98,-1; 16 1.98,-1; 17 1.98,-0.5; 18 1.98,0; 19 1.98,0.5; 20 1.98,1
L3G4200DH-MAN = smd 0.9 x 0.4: 1 -2.4,0.975; 2 -2.4,0.325; 3 -2.4,-0.325; 4 -2.4,-0.975; 9 2.4,-0.975; 10 2.4,-0.325; 11 2.4,0.325; 12 2.4,0.975 | smd 0.4 x 0.9: 5 -0.975,-2.4; 6 -0.325,-2.4; 7 0.325,-2.4; 8 0.975,-2.4; 13 0.975,2.4; 14 0.325,2.4; 15 -0.325,2.4; 16 -0.975,2.4
MOUNT-HOLE2.1 = hole 2.1: 0,0
OSCILLATOR-3.2X2.5 = smd 1.4 x 1.2: 1 -1.1,-0.85; 2 1.1,-0.85; 3 1.1,0.85; 4 -1.1,0.85

### Placement (x,y rotation side)
C1  15.24,29.84 90 top
C2  15.24,20.32 90 top
C3  15.93,13.9 315 top
C4  19.61,13.54 45 top
C5  13.34,8.89 270 top
C6  37.47,14.22 180 top
C7  39.37,27.3 90 top
C8  33.66,16.51 270 top
C9  26.67,29.84 90 top
C10  16.53,20.32 270 top
C11  32.38,16.51 270 top
C12  27.94,29.84 90 top
C13  38.73,7.37 180 top
C14  41.27,11.43 270 top
C15  20.76,12.38 225 top
C16  35.56,11.43 270 top
C17  13.97,29.84 270 top
C18  29.84,10.57 270 top
C19  26.19,2.46 90 top
C20  24.92,2.46 90 top
C21  35.56,5.08 0 top
C22  26.7,8.89 270 top
C23  25.58,4.95 0 top
C24  19.66,8.86 270 top
C25  35.56,3.81 0 top
C26  35.56,2.54 0 top
D1  37.47,26.92 270 top
F1  9.14,28.73 180 top
F2  6.5,9.55 0 top
J1  2.54,21.97 90 top
J2  45.97,17.51 270 bottom
J3  45.97,17.51 90 top
J4  3.43,7.22 270 top
J5  32.77,33.53 270 top
J6  22.23,34.16 180 top
L1  11.43,29.84 270 top
L2  6.99,28.57 90 top
L3  6.35,6.99 180 top
L4  6.35,5.71 180 top
L5  6.35,4.45 180 top
L6  21.59,29.84 270 top
L7  19.05,29.84 270 top
L8  35.56,27.3 90 top
L9  9.53,8.89 90 top
L10  10.79,8.89 90 top
L11  41.27,14.61 270 top
LED1  26.67,33.53 180 top
LED2  24.38,33.53 180 top
LED3  25.55,33.53 180 top
R1  20.32,29.84 90 top
R2  17.78,29.84 90 top
R3  19.05,26.67 90 top
R4  17.78,26.67 90 top
R5  32.13,13.89 0 top
R6  33.02,27.3 270 top
R7  16.51,29.84 270 top
R8  31.75,27.3 270 top
R9  15.24,26.67 90 top
R10  18.41,8.89 90 top
R11  12.06,8.89 90 top
R12  14.61,8.89 90 top
R13  25.4,29.84 90 top
R14  23.11,29.84 90 top
R15  24.28,29.84 90 top
R16  12.7,29.84 270 top
R17  34.29,27.3 270 top
R18  34.29,24.13 90 top
R19  17.14,8.89 90 top
R20  15.88,8.89 90 top
R21  35.56,1.27 0 top
S1  13.21,33.15 180 top
TP1  37.19,21.95 0 bottom
U1  24.77,20.32 45 top
U2  12.7,24.13 0 top
U3  8.89,24.13 0 top
U4  8.89,16.51 0 top
U5  12.7,16.51 180 top
U6  38.35,20.7 0 top
U7  38.23,10.92 90 top
U8  15.88,3.81 0 top
U9  32.72,9.96 90 top
U10  21.01,3.33 90 top
U11  23.32,9.32 0 top
U12  31.09,4.06 270 top
U$1  40,2 0 top
U$2  8,33 0 top
U$3  8,2 0 top
U$4  40,33 0 top
X1  17.65,15.75 135 top

### Tracks (layer width: path | path; a pad name or v marks a point on that pad's centre or on a via)
!JTRST  (via drill 0.3)
  Top 0.203: U1.56 20.32,25.12 v20.32,26.82
  Route2 0.203: J6.10 17.14,32.84 19.71,30.28 19.71,27.43 v20.32,26.82
ACCEL_CS  (via drill 0.3)
  Top 0.203: U1.4 19.75,18.49 20.32,18.49 20.52,18.29 v20.32,18.29 | v34.54,11.38 34.54,10.86 U9.8
  Bottom 0.203: v20.32,18.29 21.95,18.29 22.15,18.09 22.15,14.22 25.6,10.77 33.93,10.77 v34.54,11.38
ADC123_IN10  (via drill 0.3)
  Top 0.203: R11.1 13.34,9.51 C5.1 R12.2 14.43,9.72 14.43,16.26 v15.44,17.27 | v21.54,17.68 21.54,17.45 U1.8
  Bottom 0.203: v15.44,17.27 15.85,17.68 v21.54,17.68
ADC123_IN11  (via drill 0.3, 0.3 pad 0.51)
  Top 0.203: v24.38,18.09 22.88,18.09 U1.9 | J2.28 43.3,5.49 v41.66,5.49
  Route2 0.203: v37.19,13.01 38.2,11.99 v38.2,5.69
  Bottom 0.203: v24.38,18.09 29.46,13.01 v37.19,13.01 | J2.28 43.3,5.49 v41.66,5.49 41.45,5.69 v38.2,5.69
ADC123_IN12  (via drill 0.3, 0.3 pad 0.51)
  Top 0.203: v23.77,17.48 22.98,17.48 U1.10 | J2.29 48.58,3.45 v46.94,3.45
  Route2 0.203: v38.41,12.8 38.81,12.39 v38.81,5.08
  Bottom 0.203: v23.77,17.48 24.38,17.48 29.26,12.6 36.58,12.6 36.78,12.39 38,12.39 v38.41,12.8 | J2.29 48.58,3.45 v46.94,3.45 45.92,4.47 41.86,4.47 41.45,4.47 40.84,5.08 v38.81,5.08
ADC123_IN13  (via drill 0.3, 0.3 pad 0.51)
  Top 0.203: v23.98,16.66 22.88,16.66 U1.11 | J2.30 44.85,3.51 v44.91,3.45
  Route2 0.203: v39.42,12.8 v39.42,4.47
  Bottom 0.203: v23.98,16.66 28.45,12.19 36.37,12.19 36.58,11.99 38.61,11.99 v39.42,12.8 | v39.42,4.47 40.64,4.47 41.66,3.45 43.27,3.45 J2.30 43.37,3.45 v44.91,3.45
CAN1_RX  (via drill 0.3, 0.3 pad 0.51)
  Top 0.203: U1.44 30.07,28.1 v30.07,28.85 | v44.91,27.43 44.83,27.51 J2.6
  Bottom 0.203: v30.07,28.85 30.89,28.85 32.23,27.51 J2.6 43.4,27.43 v44.91,27.43
CAN1_TX  (via drill 0.3)
  Top 0.203: U1.45 29.26,28 v29.26,29.46 | v46.94,27.64 47.07,27.51 J2.5
  Bottom 0.203: v29.26,29.46 31.29,29.46 32.11,28.65 45.92,28.65 v46.94,27.64 47.07,27.51 J2.5
GND  (via drill 0.3)
  Top 0.203: U2.2 12.38,20.32 11.72,20.32 U5.4
  Top 0.254: C14.2 41.13,10.92 | C17.1 C1.2 15.24,30.86 16.13,31.75 16.13,33.66 | 25.4,29.23 C9.2 | C21.2 C25.2 36.26,3.86 v37.19,3.86 | R12.1 C5.2 13.26,8.24 v13.26,6.99 | U8.1 U8.2 U8.3 U8.4 v18.09,1.41 19.59,1.41 U10.1 | 19.12,13.08 X1.4 | X1.4 16.9,13.44 C3.2 16.16,13.21 | X1.2 16.53,18.08 16.53,18.69 | 16.53,18.69 C10.2 | 16.13,33.66 16.13,33.87 S1.B3 | 16.13,33.66 16.64,34.16 J6.9 J6.5 J6.3 | U11.17 26.11,8.82 C22.2 26.7,5.42 C23.2 26.23,4.66 v27.03,3.86 | U9.13 U9.12 32.22,12.1 32.31,12.19 32.92,12.19 | 32.92,12.19 33.12,12.19 33.22,12.1 U9.10 | U12.8 27.8,3.09 v27.03,3.86 | U12.12 U12.11 U12.10 U12.9 28.82,1.66 28.65,1.83 28.65,3.05 | 32.1,1.63 33.12,1.63 33.22,1.73 | 33.22,1.73 33.49,1.99 U12.13 | v33.73,1.27 33.68,1.27 33.53,1.42 | v33.73,1.27 R21.1 | 33.22,1.73 33.53,1.42 | 30.27,33.08 J5.GND3 29.53,30.5 C12.2 | 35.27,33.08 J5.GND2 35.74,31.7 v36.58,31.7 | 30.77,30.73 J5.5 30.43,30.73 30.28,30.89 30.28,31.7 v29.06,31.7 | C8.2 C11.2 32.38,14.29 R5.2 32.78,12.33 32.92,12.19 | U1.18 27.03,13.46 27.03,13.01 26.62,12.6 26.01,12.6 24.99,13.61 v24.99,13.82 | U9.16 30.3,9.46 C18.2 29.46,9.54 v29.46,9.04 | v27.03,3.86 26.28,3.11 C19.2 C20.2 24.99,3.19 | 40.64,7.87 C13.C 40.19,7.32 | v46.94,5.49 46.96,5.51 | v41.45,7.32 41.65,7.51 | v33.73,1.27 33.58,1.42 33.53,1.42 | U11.12 22.82,7.87 v22.35,8.33 | U4.2 8.56,16.63 v8.53,16.66 | U3.2 8.56,22.93 v8.53,22.96 | C2.2 15.24,21.74 v15.65,22.15 15.65,22.35 16.05,22.76 17.73,22.76 U1.63 | v12.39,22.35 12.39,21.25 U2.2 | v23.16,15.85 22.77,15.85 U1.12 | v37.19,10.97 36.98,10.77 35.57,10.77 C16.2 | 16.53,18.69 v16.87,18.69 | C15.2 19.15,13.07 C4.1 | 43.36,29.46 J2.4 | v46.94,29.46 46.94,29.51
  Top 0.254: U6.1 35.76,17.88 | v34.34,22.15 34.34,23.43 R18.1 | v17.88,12.8 17.88,14.32 X1.4 | U9.5 34.14,8.11 v34.14,7.52 | 3.47,13.22 v3.45,13.21 | J4.1 2.15,7.22 v2.03,7.11 | J4.5 2.06,3.23 v2.03,3.25 | C7.2 39.42,27.95
  Top 0.381: C16.2 35.7,10.92 | C9.2 C12.2 | R13.1 25.4,29.23 | C4.1 19.12,13.08 | U12.12 32.1,1.63 | U12.8 28.65,3.05 | 30.27,33.08 J5.GND4 | 35.27,33.08 J5.GND1 | J5.GND3 30.77,30.73 | 39.42,27.95 v39.42,29.87
  Top 0.508: 41.13,10.92 U7.2 | C8.2 34.3,15.86 U6.1 | C14.2 40.64,10.14 40.64,7.87 | 46.96,5.51 J3.27 | 41.65,7.51 J3.26 | 40.19,7.32 v41.45,7.32 | v44.91,29.46 43.36,29.46 | 46.94,29.51 J2.3 | v37.59,14.22 C6.C | 35.76,17.88 v34.95,17.88 | J1.15 3.47,13.22
  Bottom 0.254: 48.59,29.46 J2.3 | J2.4 43.36,29.46
  Bottom 0.508: v46.94,29.46 48.59,29.46 | 43.36,29.46 v44.91,29.46
  pour Route15 (isolate 0.305): 0.2,34.75 0.2,0.2 49.78,0.2 49.78,34.75
GPIO1  (via drill 0.3)
  Top 0.203: U5.2 12.95,19.34 | U1.24 27.23,17.5 v27.23,18.29 | U5.2 13.01,19.39 | v14.63,17.68 13.82,18.49 13.21,18.49 13.03,18.67 U5.2
  Bottom 0.203: v14.63,17.68 16.46,19.51 21.95,19.51 22.76,18.69 26.82,18.69 v27.23,18.29
GPIO2  (via drill 0.3)
  Top 0.203: U1.25 27.84,17.6 v27.84,18.9 | 12.39,19.39 U5.3 12.38,18.71 v13.41,17.68
  Bottom 0.203: v13.41,17.68 15.65,19.91 22.15,19.91 22.96,19.1 27.64,19.1 v27.84,18.9
GPIO_EXT1  (via drill 0.3, 0.3 pad 0.51)
  Top 0.203: v41.66,9.55 41.7,9.51 J2.24 | J1.13 6.63,15.72 v6.71,15.65 | v13.01,14.83 13.03,14.81 U5.7 13.03,11.77 v13.21,11.58
  Bottom 0.203: v13.01,14.83 7.52,14.83 v6.71,15.65 | v13.21,11.58 18.29,11.58 19.51,10.36 40.84,10.36 v41.66,9.55 41.7,9.51 J2.24
GPIO_EXT2  (via drill 0.3, 0.3 pad 0.51)
  Top 0.203: v12.8,15.65 12.38,15.22 U5.6 12.38,10.99 v12.39,10.97 | v46.94,7.52 46.95,7.51 J2.25 | J1.12 6.6,16.97 v6.71,16.87
  Bottom 0.203: v6.71,16.87 7.11,16.87 8.33,15.65 v12.8,15.65 | J2.25 48.62,7.52 v46.94,7.52 45.92,8.53 41.66,8.53 40.23,9.96 19.3,9.96 18.09,11.18 13.82,11.18 13.61,10.97 v12.39,10.97
GYRO_CS  (via drill 0.3)
  Top 0.203: U1.3 19.45,18.9 v20.93,18.9 | v27.23,11.38 27.64,10.97 27.64,5.69 28.29,5.04 U12.5
  Bottom 0.203: v20.93,18.9 21.95,18.9 22.55,18.29 22.55,14.43 25.6,11.38 v27.23,11.38
I2C1_SCL
  Top 0.203: U1.61 18.41,23.5 18.41,25.39 R3.1
I2C1_SCL_EXT
  Top 0.203: R3.2 20.32,28.59 R1.1 21.59,30.46 L6.1
I2C1_SDA
  Top 0.203: R4.1 17.78,23.42 U1.62
I2C2_SCL  (via drill 0.3)
  Top 0.203: R20.1 16.2,7.92 U8.6 16.2,4.93 v16.36,4.78 17.07,4.06 20.73,4.06 21.01,4.34 U10.6 | v30.89,15.85 31.09,16.05 31.09,17.18 U1.29 | U11.1 24.32,10.7 23.37,9.75 v23.37,9.35 | 47,15.51 v46.94,15.44 47,15.51 | 47,15.51 J2.17
  Route2 0.203: v30.89,15.85 30.48,15.85 28.85,14.22 28.85,11.99 26.21,9.35 v23.37,9.35 22.96,9.75 18.69,9.75 16.36,7.42 v16.36,4.78
  Bottom 0.203: v30.89,15.85 31.5,16.46 45.72,16.46 45.92,16.46 v46.94,15.44 47,15.51 J2.17
I2C2_SDA  (via drill 0.3, 0.3 pad 0.51)
  Top 0.203: R19.1 16.85,7.95 U8.5 16.87,6.23 | U1.30 31.5,17.48 v31.5,15.04 | U11.20 24.75,10.32 23.98,9.55 23.98,8.94 23.57,8.53 23.16,8.53 v22.55,9.14 | 16.87,6.23 16.87,7.32 | 16.87,6.23 v17.68,6.23 18.9,6.23 U10.7 | v44.91,15.44 44.84,15.51 J2.18
  Route2 0.203: v31.5,15.04 30.28,15.04 29.26,14.02 29.26,11.79 26.01,8.53 23.16,8.53 v22.55,9.14 18.69,9.14 17.68,8.13 v17.68,6.23
  Bottom 0.203: v31.5,15.04 31.97,15.51 J2.18 43.38,15.44 v44.91,15.44
I2C2_SDA_EXT
  Top 0.203: R4.2 R2.1 17.78,29.23 L7.1
I2C3_SCL  (via drill 0.3)
  Top 0.203: U1.41 29.49,25.4 v30.48,25.4 | v46.94,23.57 47,23.51 J2.9
  Bottom 0.203: v30.48,25.4 31.09,26.01 40.44,26.01 41.86,24.59 45.72,24.59 45.92,24.59 v46.94,23.57 47,23.51 J2.9
I2C3_SDA  (via drill 0.3, 0.3 pad 0.51)
  Top 0.203: v44.91,23.57 44.84,23.51 J2.10 | U1.40 29.59,24.79 29.87,24.79 30.89,24.79 v31.5,25.4
  Bottom 0.203: v31.5,25.4 40.23,25.4 42.13,23.51 J2.10 43.38,23.57 v44.91,23.57
JTCK-SWCLK  (via drill 0.3)
  Top 0.203: v22.35,28.04 U1.49
  Route2 0.203: J6.4 22.35,31.5 v22.35,28.04
JTDI  (via drill 0.3)
  Top 0.203: v21.54,26.82 21.95,27.23 22.45,27.23 U1.50
  Route2 0.203: J6.8 18.41,32.79 20.12,31.09 20.12,28.25 v21.54,26.82
JTDO  (via drill 0.3)
  Top 0.203: U1.55 20.73,25.42 20.73,25.6 20.73,26.01 v20.93,26.21
  Route2 0.203: v20.93,26.21 21.34,25.81 21.74,25.81 21.95,26.01 22.35,26.42 22.35,27.03 21.74,27.64 21.74,30.84 J6.6
JTMS-SWDIO  (via drill 0.3)
  Top 0.203: U1.46 28.04,27.49 v28.04,28.04
  Route2 0.203: v28.04,28.04 23.19,32.89 J6.2
LED_AMBER
  Top 0.203: R14.1 23.11,28.09 24.79,26.42 24.79,24.59 22.96,22.76 21.27,22.76 U1.58
LED_BLUE
  Top 0.203: R15.1 24.28,27.94 25.2,27.03 25.2,24.38 23.16,22.35 20.96,22.35 U1.59
N$1
  Top 0.203: U1.6 19.03,16.36 X1.1 20.07,14.53 C4.2
N$2
  Top 0.203: C3.1 15.47,15.12 X1.3 16.45,15.75 17.65,15.75 19.43,17.53 U1.5
N$3
  Top 0.203: 6.74,29.47 L2.2
  Top 0.381: J1.2 6.74,29.47
N$4
  Top 0.203: U1.31 32.38,17.3 C11.1
N$5
  Top 0.203: 7.23,9.43 F2.2 7.35,7.34 L3.1
N$6
  Top 0.203: U1.47 27.23,27.38 27.23,28.25 27.94,28.96 C12.1
N$7
  Top 0.203: R6.1 33.02,28.57 33.42,28.97 J5.2
N$8
  Top 0.203: R8.1 31.75,28.57 32.77,29.59 J5.3
N$9
  Top 0.203: U7.4 35.77,11.87 C16.1
N$11  (via drill 0.3)
  Top 0.254: R9.2 15.35,27.43 v16.26,27.43
  Top 0.381: R7.2 16.51,29.21 15.26,29.21 C1.1 R9.2 15.35,27.32 | v12.32,25.93 12.38,25.99 U2.7 | U3.7 8.51,26.97 v8.51,25.93
  Bottom 0.254: v8.51,25.93 v12.32,25.93 13.82,27.43 v16.26,27.43
N$12  (via drill 0.3)
  Top 0.203: v6.91,24.38 6.82,24.47 J1.6 | U2.8 v10.98,27.03 v10.97,27.03
  Bottom 0.203: v10.97,27.03 8.33,27.03 6.91,25.6 v6.91,24.38
N$13  (via drill 0.3)
  Top 0.203: U2.1 11.72,22.21 v11.58,22.35 | v6.71,23.16 6.65,23.22 J1.7
  Bottom 0.203: v11.58,22.35 7.52,22.35 v6.71,23.16
N$14
  Top 0.381: 11.24,29.2 L1.2
  Top 0.508: 11.24,29.2 9.72,30.72 J1.1
N$15
  Top 0.203: U3.8 6.61,25.72 J1.5
N$16
  Top 0.203: U3.1 7.17,21.97 J1.8
N$19  (via drill 0.3)
  Top 0.203: L6.2 21.59,28.7 v21.13,28.25 | v3.45,28.25 3.48,28.22 J1.3
  Bottom 0.203: v21.13,28.25 20.12,29.26 8.94,29.26 7.92,28.25 v3.45,28.25
N$21
  Top 0.203: J4.3 4.62,5.22 4.88,5.49 5.11,5.71 L4.2
N$22  (via drill 0.3)
  Top 0.203: S1.A1 12.7,32.42 R16.1 12.7,30.46 C17.2 14.22,28.94 14.22,23.57 14.83,22.96 v14.83,22.55 | U1.7 20.93,17.55 20.93,18.09 21.13,18.29 21.34,18.29 21.54,18.49 21.54,19.91 v19.71,21.74
  Bottom 0.203: v19.71,21.74 18.69,22.76 15.04,22.76 v14.83,22.55
N$23
  Top 0.381: L8.1 35.94,26.27 D1.ANODE
N$24
  Top 0.254: J4.2 4.4,6.22 4.67,6.5 5.16,6.99 L3.2
N$25
  Top 0.203: J4.4 4.83,4.22 4.88,4.27 5.05,4.45 L5.2
N$26  (via drill 0.3)
  Top 0.203: L7.2 19.05,28.4 v18.9,28.25 | v6.91,27.03 6.85,26.97 J1.4
  Bottom 0.203: v18.9,28.25 18.29,28.85 9.14,28.85 7.32,27.03 v6.91,27.03
N$27
  Top 0.254: F1.2 8.21,28.65 8.13,28.65 | L2.1 7.4,27.93
  Top 0.381: 7.4,27.93 8.13,28.65
N$28
  Top 0.203: R15.2 24.28,30.99 25.55,32.26 LED3.C
N$29
  Top 0.203: R13.2 26.67,31.77 LED1.C
N$30
  Top 0.203: R14.2 23.11,31.51 LED2.C
N$31  (via drill 0.3)
  Top 0.203: R10.2 18.41,9.83 v17.68,10.57 | v9.55,7.11 9.55,8.21 L9.1
  Bottom 0.203: v17.68,10.57 14.83,7.72 10.36,7.72 10.16,7.72 v9.55,7.11
N$32  (via drill 0.3)
  Top 0.203: L9.2 9.53,9.93 v10.16,10.57 | v7.11,10.97 7.11,14.83 7.32,15.04 7.32,17.48 6.71,18.09 6.57,18.22 J1.11
  Bottom 0.203: v10.16,10.57 7.52,10.57 v7.11,10.97
N$33
  Top 0.203: R21.2 C26.2
N$34
  Top 0.203: C26.1 C25.1 34.84,3.74 U12.14
N$35
  Top 0.203: L10.1 10.79,8.27 R11.2
N$36
  Top 0.203: C23.1 24.32,5.56 U11.15 24.32,7.99 24.18,8.13 23.37,8.13 23.32,8.08 U11.13
N$37  (via drill 0.3)
  Top 0.203: L10.2 10.79,9.98 v11.38,10.57 | v6.3,11.58 6.5,11.79 6.5,14.02 6.05,14.47 J1.14
  Bottom 0.203: v11.38,10.57 10.36,11.58 v6.3,11.58
N$39
  Top 0.203: U11.14 23.82,6.75 23.67,6.6 21.27,6.6 C24.2
N$40
  Top 0.203: C24.1 20.35,8.82 U11.9
N$100
  Top 0.254: L11.2 C14.1 41.07,11.87 U7.3 38.54,11.87 38.3,11.63 38.3,10.34 38.67,9.97 U7.1
OTG_HS_DM
  Top 0.203: U1.35 33.02,24.69 R6.2
OTG_HS_DP
  Top 0.203: U1.36 32.51,24.89 32.51,25.81 31.75,26.57 R8.2
PB2-BOOT1
  Top 0.203: U1.28 30.68,16.88 30.68,16.66 30.28,16.26 30.28,14.43 30.81,13.89 R5.1
PB12  (via drill 0.3)
  Top 0.203: v12.8,17.07 12.8,16.66 11.72,15.59 U5.5 | U1.33 29.26,19.51 v28.65,19.51
  Bottom 0.203: v12.8,17.07 12.8,18.49 14.63,20.32 22.35,20.32 23.16,19.51 v28.65,19.51
PPM_INPUT  (via drill 0.3)
  Top 0.203: U1.26 29.87,16.27 v29.87,13.61 | R10.1 18.41,7.39 arc90 v18.49,7.32 | v46.94,9.55 46.98,9.51 J2.23
  Route2 0.203: v18.49,7.32 25.4,7.32 29.87,11.79 v29.87,13.61
  Bottom 0.203: v29.87,13.61 39.62,13.61 40.23,13.01 40.23,11.79 41.66,10.36 46.13,10.36 v46.94,9.55 48.59,9.55 J2.23
SPI1_MISO  (via drill 0.3)
  Top 0.203: U1.22 28.45,14.87 28.45,7.92 v28.85,7.52 29.67,7.52 30.11,7.07 U12.4 30.07,6.5 | U9.7 35.15,9.96 v36.17,8.94
  Bottom 0.203: v36.17,8.94 35.56,8.33 34.75,8.33 34.54,8.53 30.89,8.53 29.87,7.52 v28.85,7.52
SPI1_MOSI  (via drill 0.3)
  Top 0.203: U1.23 28.85,15.17 28.85,8.74 v29.46,8.13 29.67,8.13 30.77,7.03 U12.3 | U9.6 34.64,9.46 v35.15,8.94
  Bottom 0.203: v35.15,8.94 30.68,8.94 29.87,8.13 v29.46,8.13
SPI1_SCK  (via drill 0.3)
  Top 0.203: U1.21 28.04,14.57 28.04,7.11 v28.25,6.91 | U12.2 31.41,7.4 v31.09,7.72 | v33.33,7.52 33.22,7.63 U9.4
  Bottom 0.203: v28.25,6.91 30.28,6.91 v31.09,7.72 31.29,7.92 32.92,7.92 v33.33,7.52
SPI3_MISO  (via drill 0.3)
  Top 0.203: J2.13 v46.94,19.51 | v23.98,24.79 23.48,24.79 U1.52
  Bottom 0.203: v23.98,24.79 24.59,24.79 25.6,25.81 27.84,25.81 29.67,23.98 39.22,23.98 41.05,22.15 41.05,21.13 41.66,20.52 45.72,20.52 45.92,20.52 v46.94,19.51 J2.13
SPI3_MOSI  (via drill 0.3)
  Top 0.203: 20.56,24.15 U1.57 21.16,23.57 21.34,23.57 21.54,23.57 v21.74,23.77 | v41.66,21.54 41.69,21.51 J2.12
  Bottom 0.203: v21.74,23.77 23.37,25.4 24.59,25.4 25.4,26.21 28.04,26.21 29.87,24.38 39.42,24.38 41.66,22.15 v41.66,21.54 41.69,21.51 J2.12
SPI3_NSS  (via drill 0.3)
  Top 0.203: U1.20 26.62,15.28 26.62,21.13 27.03,21.54 27.03,22.55 26.21,23.37 v26.21,24.99 | J2.14 v41.66,19.51
  Bottom 0.203: J2.14 v41.66,19.51 40.64,20.52 40.64,21.74 38.81,23.57 29.46,23.57 28.04,24.99 v26.21,24.99
SPI3_SCK  (via drill 0.3)
  Top 0.203: U1.51 23.17,25.81 23.98,25.81 v24.18,26.01 | v46.94,21.54 46.97,21.51 J2.11
  Bottom 0.203: v24.18,26.01 24.79,26.62 28.25,26.62 30.07,24.79 39.83,24.79 42.27,22.35 45.72,22.35 46.13,22.35 v46.94,21.54 46.97,21.51 J2.11
UART5_RX  (via drill 0.3, 0.3 pad 0.51)
  Top 0.203: v44.91,17.48 43.35,17.48 J2.16 | v22.76,23.57 22.76,24.09 U1.54
  Bottom 0.203: v22.76,23.57 24.38,23.57 24.79,23.98 27.84,23.98 29.06,22.76 38.41,22.76 39.83,21.34 39.83,18.49 40.84,17.48 43.29,17.48 J2.16 44.87,17.51 v44.91,17.48
UART5_TX  (via drill 0.3)
  Top 0.203: J2.15 46.97,17.51 v46.94,17.48 | v23.37,24.18 23.37,24.19 U1.53
  Bottom 0.203: v23.37,24.18 24.38,24.18 24.59,24.38 28.04,24.38 29.26,23.16 38.61,23.16 40.23,21.54 40.23,19.3 41.05,18.49 45.72,18.49 45.92,18.49 v46.94,17.48 46.97,17.51 J2.15
USART1_RX  (via drill 0.3)
  Top 0.203: U4.4 9.87,17.79 10.97,18.9 10.97,24.59 v11.58,25.2 | v29.87,27.03 29.7,27.03 U1.43
  Bottom 0.203: v11.58,25.2 21.54,25.2 23.77,27.43 29.46,27.43 v29.87,27.03
USART1_RX_EXT  (via drill 0.3)
  Top 0.203: U4.1 7.92,17.89 6.33,19.47 J1.10 2.88,19.47 v2.85,19.51 | J2.8 43.41,25.6 v44.91,25.6
  Bottom 0.203: v2.85,19.51 2.85,28.85 3.66,29.67 21.34,29.67 22.15,28.85 28.25,28.85 29.26,27.84 30.07,27.84 31.5,26.42 40.58,26.42 41.05,26.42 41.86,25.6 41.95,25.51 J2.8 44.81,25.51 v44.91,25.6
USART1_TX  (via drill 0.3)
  Top 0.203: U1.42 29.39,26.01 v29.87,26.01 | U4.5 10.57,20.11 v10.57,25.2
  Bottom 0.203: v10.57,25.2 11.38,24.38 11.79,24.38 12.19,24.79 21.95,24.79 24.18,27.03 28.85,27.03 v29.87,26.01
USART1_TX_EXT  (via drill 0.3)
  Top 0.203: U4.8 6.6,20.72 J1.9 v2.04,20.72 v2.03,20.73 | J2.7 47.03,25.51 v46.94,25.6
  Bottom 0.203: v2.03,20.73 2.03,28.65 3.45,30.07 21.54,30.07 22.35,29.26 28.45,29.26 29.46,28.25 30.28,28.25 31.7,26.82 41.25,26.82 41.45,26.62 45.89,26.62 46.91,25.6 v46.94,25.6 | v46.94,25.6 47.03,25.51 | 47.03,25.51 J2.7 47.03,25.51 | v46.94,25.6 47.03,25.51
USART2_CTS  (via drill 0.3, 0.3 pad 0.51)
  Top 0.203: v24.38,21.54 24.38,19.1 24.99,18.49 24.99,16.66 U1.14 | v13.41,23.37 13.68,23.63 U2.5 | 47.04,13.51 J2.19 | 47.04,13.51 v46.94,13.41 47.04,13.51
  Route2 0.203: v37.59,19.91 39.42,19.91 45.92,13.41 v46.94,13.41
  Bottom 0.203: v13.41,23.37 13.61,23.57 19.51,23.57 21.13,21.95 23.16,21.95 23.57,21.54 v24.38,21.54 27.84,21.54 28.45,21.54 30.07,19.91 v37.59,19.91 | v46.94,13.41 48.53,13.41 J2.19
USART2_RTS  (via drill 0.3, 0.3 pad 0.51)
  Top 0.203: U2.4 13.68,22.41 v14.02,22.76 | v24.99,20.93 25.4,20.52 25.4,16.36 U1.15 | J2.20 44.81,13.51 v44.91,13.41
  Route2 0.203: v36.98,19.3 39.01,19.3 v44.91,13.41
  Bottom 0.203: v14.02,22.76 14.43,23.16 19.3,23.16 20.93,21.54 22.96,21.54 23.57,20.93 v24.99,20.93 25.2,21.13 28.25,21.13 30.07,19.3 v36.98,19.3 | v44.91,13.41 43.42,13.41 J2.20
USART2_RX  (via drill 0.3, 0.3 pad 0.51)
  Top 0.203: U3.4 9.87,22.87 v9.96,22.96 | v26.42,22.15 26.42,21.74 26.21,21.54 26.21,15.85 25.6,15.24 25.6,14.18 U1.17 | v39.22,20.52 39.42,20.32 39.42,16.05 40.23,15.24 v40.23,14.02 | v44.91,11.38 44.78,11.51 J2.22
  Bottom 0.203: v9.96,22.96 10.16,23.16 11.79,23.16 12.6,23.98 19.71,23.98 21.34,22.35 23.37,22.35 23.57,22.15 v26.42,22.15 28.45,22.15 30.07,20.52 v39.22,20.52 | v40.23,14.02 40.64,13.61 40.64,12.19 41.32,11.51 J2.22 43.45,11.38 v44.91,11.38
USART2_TX  (via drill 0.3, 0.3 pad 0.51)
  Top 0.203: v25.81,22.76 25.81,16.06 24.48,14.73 | 24.48,14.73 U1.16 | U3.5 9.87,24.07 v9.96,23.98 | J2.21 47.01,11.51 v46.94,11.58 | v24.79,14.63 24.58,14.63 24.48,14.73
  Route2 0.203: v27.23,16.46 26.21,16.46 24.79,15.04 v24.79,14.63
  Bottom 0.203: v9.96,23.98 11.99,23.98 12.39,24.38 20.12,24.38 21.74,22.76 v25.81,22.76 | J2.21 48.55,11.58 v46.94,11.58 46.13,12.39 42.67,12.39 41.25,12.39 41.05,12.6 41.05,14.22 40.44,14.83 32.51,14.83 31.9,14.22 29.46,14.22 v27.23,16.46
USART6_RX  (via drill 0.3)
  Top 0.203: v27.23,20.52 27.23,21.02 U1.38 | v11.38,18.09 10.57,17.27 10.57,12.6 8.33,10.36 8.33,7.32 8.33,7.11 8.33,6.71 7.34,5.71 L4.1
  Bottom 0.203: v11.38,18.09 11.38,18.29 14.22,21.13 22.76,21.13 23.57,20.32 27.03,20.32 v27.23,20.52
USART6_TX  (via drill 0.3)
  Top 0.203: U1.37 28.04,21.12 v28.04,20.12 | v11.58,17.27 10.97,16.66 10.97,12.39 8.74,10.16 8.74,7.11 8.74,6.91 8.74,5.89 7.29,4.45 L5.1
  Bottom 0.203: v11.58,17.27 12.19,17.88 12.19,18.49 14.43,20.73 22.55,20.73 23.37,19.91 27.84,19.91 v28.04,20.12
VBUS
  Top 0.254: R17.1 34.34,28.01
  Top 0.381: J5.1 34.04,30.7 34.04,28.75 34.34,28.45 34.34,28.01
  Top 0.508: R17.1 L8.2
VBUS_DETECT  (via drill 0.3, 0.3 pad 0.51)
  Top 0.203: U1.60 20.66,21.95 23.37,21.95 24.79,23.37 v25.2,23.37 | R17.2 R18.2 33.82,24.78 U1.34 31.8,22.76 32.11,22.76 v32.72,22.15
  Bottom 0.203: v25.2,23.37 27.84,23.37 29.67,21.54 32.72,21.54 | 32.72,21.54 36.78,21.54 TP1.P$1 | 32.72,21.54 v32.72,22.15
VDD_3V3  (via drill 0.3)
  Top 0.203: 13.72,19.67 13.72,20.32 13.03,20.32 U2.3
  Top 0.254: U1.32 32.49,18.94 33.66,17.78 C8.1 33.66,17.75 v33.12,18.29 | U1.48 26.67,27.53 C9.1 26.67,28.5 v26.42,28.25 | U4.7 U4.6 U3.3 9.21,23.5 v9.14,23.57 | U5.1 13.94,19.67 | 13.94,19.67 C2.1 16.53,20.96 | 13.94,19.67 13.72,19.67 | R19.2 R20.2 15.85,9.56 v15.85,10.57 | 16.53,20.96 17.34,20.96 | 17.34,20.96 U1.64 | v12.7,23.06 13.03,22.74 U2.3 | LED1.A LED3.A LED2.A 22.34,34.28 J6.1 | U3.6 9.21,27.95 F1.1 | U9.1 31.71,7.81 32.06,7.46 32.06,7.32 | U12.1 32.06,7.32 | 32.06,7.32 v32.51,7.32 | U1.19 27.53,13.66 27.53,12.7 27.43,12.6 v27.43,12.19 | U1.1 18.08,20.21 17.34,20.96 | 16.53,20.96 C10.1 16.46,21.04 v16.46,21.95 | v14.22,6.1 14.79,6.1 U8.8 | 24.58,1.81 C20.1 23.79,1.81 v23.57,2.03 23.07,2.53 U10.4 22.63,3.33 | 13.03,28.04 U2.6 | 13.03,28.04 13.03,28.23 v13.01,28.25 12.7,28.55 R16.2 | F1.1 10.69,28.04 13.03,28.04 | F1.1 9.99,28.82 | U6.4 U6.2 38.08,17.88 | U4.3 9.21,12.67 v8.94,12.39 | R9.1 16.25,26.02 v16.26,26.01 | v4.47,8.94 5.04,8.94 F2.1
  Top 0.381: 15.22,26.04 R9.1
  Top 0.508: v34.75,14.22 C6.A | 38.08,17.88 v37.19,17.88
  pour Route2 (isolate 0.305): 0.2,34.75 0.2,0.2 49.78,0.2 49.78,34.75
VDD_3V3_ANALOG  (via drill 0.3)
  Top 0.254: U1.13 22.32,14.7 21.59,13.97 | U7.5 37.34,9.56 C13.A | 34.87,5.04 U12.16 U12.15 | C22.1 26.48,9.32 U11.18 24.77,9.32 24.49,9.04 24.49,8.64 24.8,8.32 U11.16 25.3,6.61 | U9.15 U9.14 30.53,11.22 | v34.95,6.1 34.95,5.12 C21.1 | 30.53,11.22 C18.1 | v30.89,11.58 v30.89,11.57 30.53,11.22 | U10.3 22.73,0.81 25.81,0.81 26.19,1.19 C19.1 27.21,1.81 v27.23,1.83
  Top 0.381: 21.59,13.97 21.59,13.21 C15.1 21.86,12.19 24.79,12.19 26.7,10.29 C22.1 | C21.1 34.87,5.04 | C13.A 36.22,7.37 v34.95,6.1 | v25.4,6.5 25.3,6.61
  Route2 0.254: 30.79,6.2 30.89,6.1
  Route2 0.381: 30.89,6.1 v34.95,6.1 | v27.23,1.83 30.79,5.38 30.79,6.2 30.28,6.71 30.28,10.97 v30.89,11.58 25.81,6.5 v25.4,6.5
VDD_5V  (via drill 0.3, 0.3 pad 0.51)
  Top 0.254: 42.3,31.51 J2.2 arc90 43.33,31.5 | U6.3 40.66,15.87 L11.1 | 17.27,30.5 R7.1 | 17.27,30.5 R2.2 17.78,31.19 18.29,31.7 19.71,31.7 20.32,31.09 R1.2 | v17.27,31.5 17.27,30.5 | 38.98,26.66 C7.1 39.38,26.67 | v13.82,12.39 13.68,12.54 U5.8 | v46.94,31.5 arc-90 46.95,31.51 arc-90 v46.94,31.5
  Top 0.381: 40.64,26.67 40.66,26.64 | v10.57,31.29 10.63,31.29 | v37.39,30.89 37.47,30.81 | D1.CATHODE 38.98,26.66
  Top 0.406: 39.38,26.67 40.64,26.67
  Top 0.508: U6.3 40.66,26.64 40.66,29.87 42.3,31.51 | 37.47,30.81 D1.CATHODE | 10.63,31.29 L1.1 | 46.95,31.51 J2.1 | 43.33,31.5 v44.91,31.5 v46.94,31.5
  Route2 0.254: v13.82,12.39 13.82,13.01 7.72,19.1 7.72,28.45 v10.57,31.29
  Bottom 0.254: 48.62,31.5 arc90 J2.1 | v44.91,31.5 arc90 44.9,31.51
  Bottom 0.508: v10.57,31.29 10.77,31.5 v17.27,31.5 17.88,30.89 v37.39,30.89 | v46.94,31.5 48.62,31.5 | 44.9,31.51 J2.2

### Text on the board
tPlace: (c) 2011 mjs
bPlace: PX2 v1.0 | 5V | 3.3V | SCL | SDA | UA2_TX | UA2_CTS | UA2_RTS | UA2_RX | UA1_TX | UA1_RX | PPM | GPIO1 | GPIO2 | Batt mon | GND | GPS